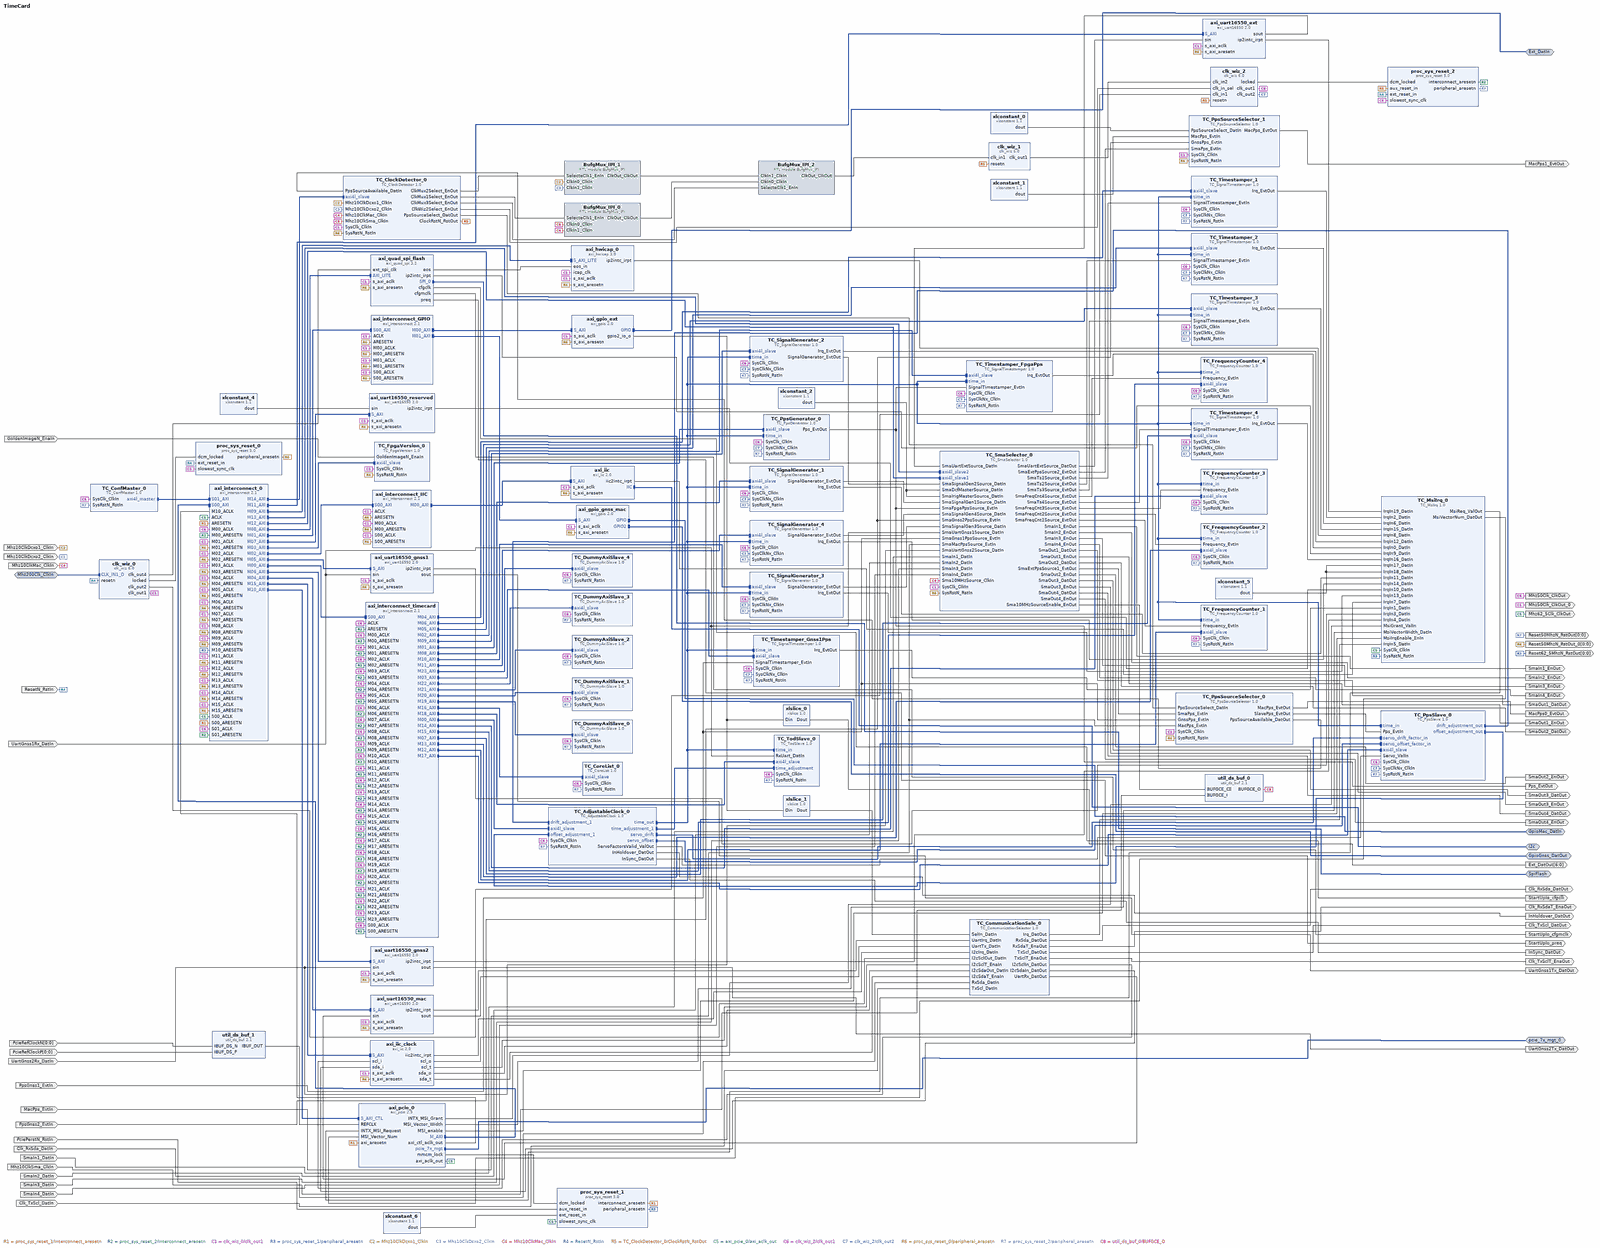
[diagram p0: block diagram of the top level, whole]
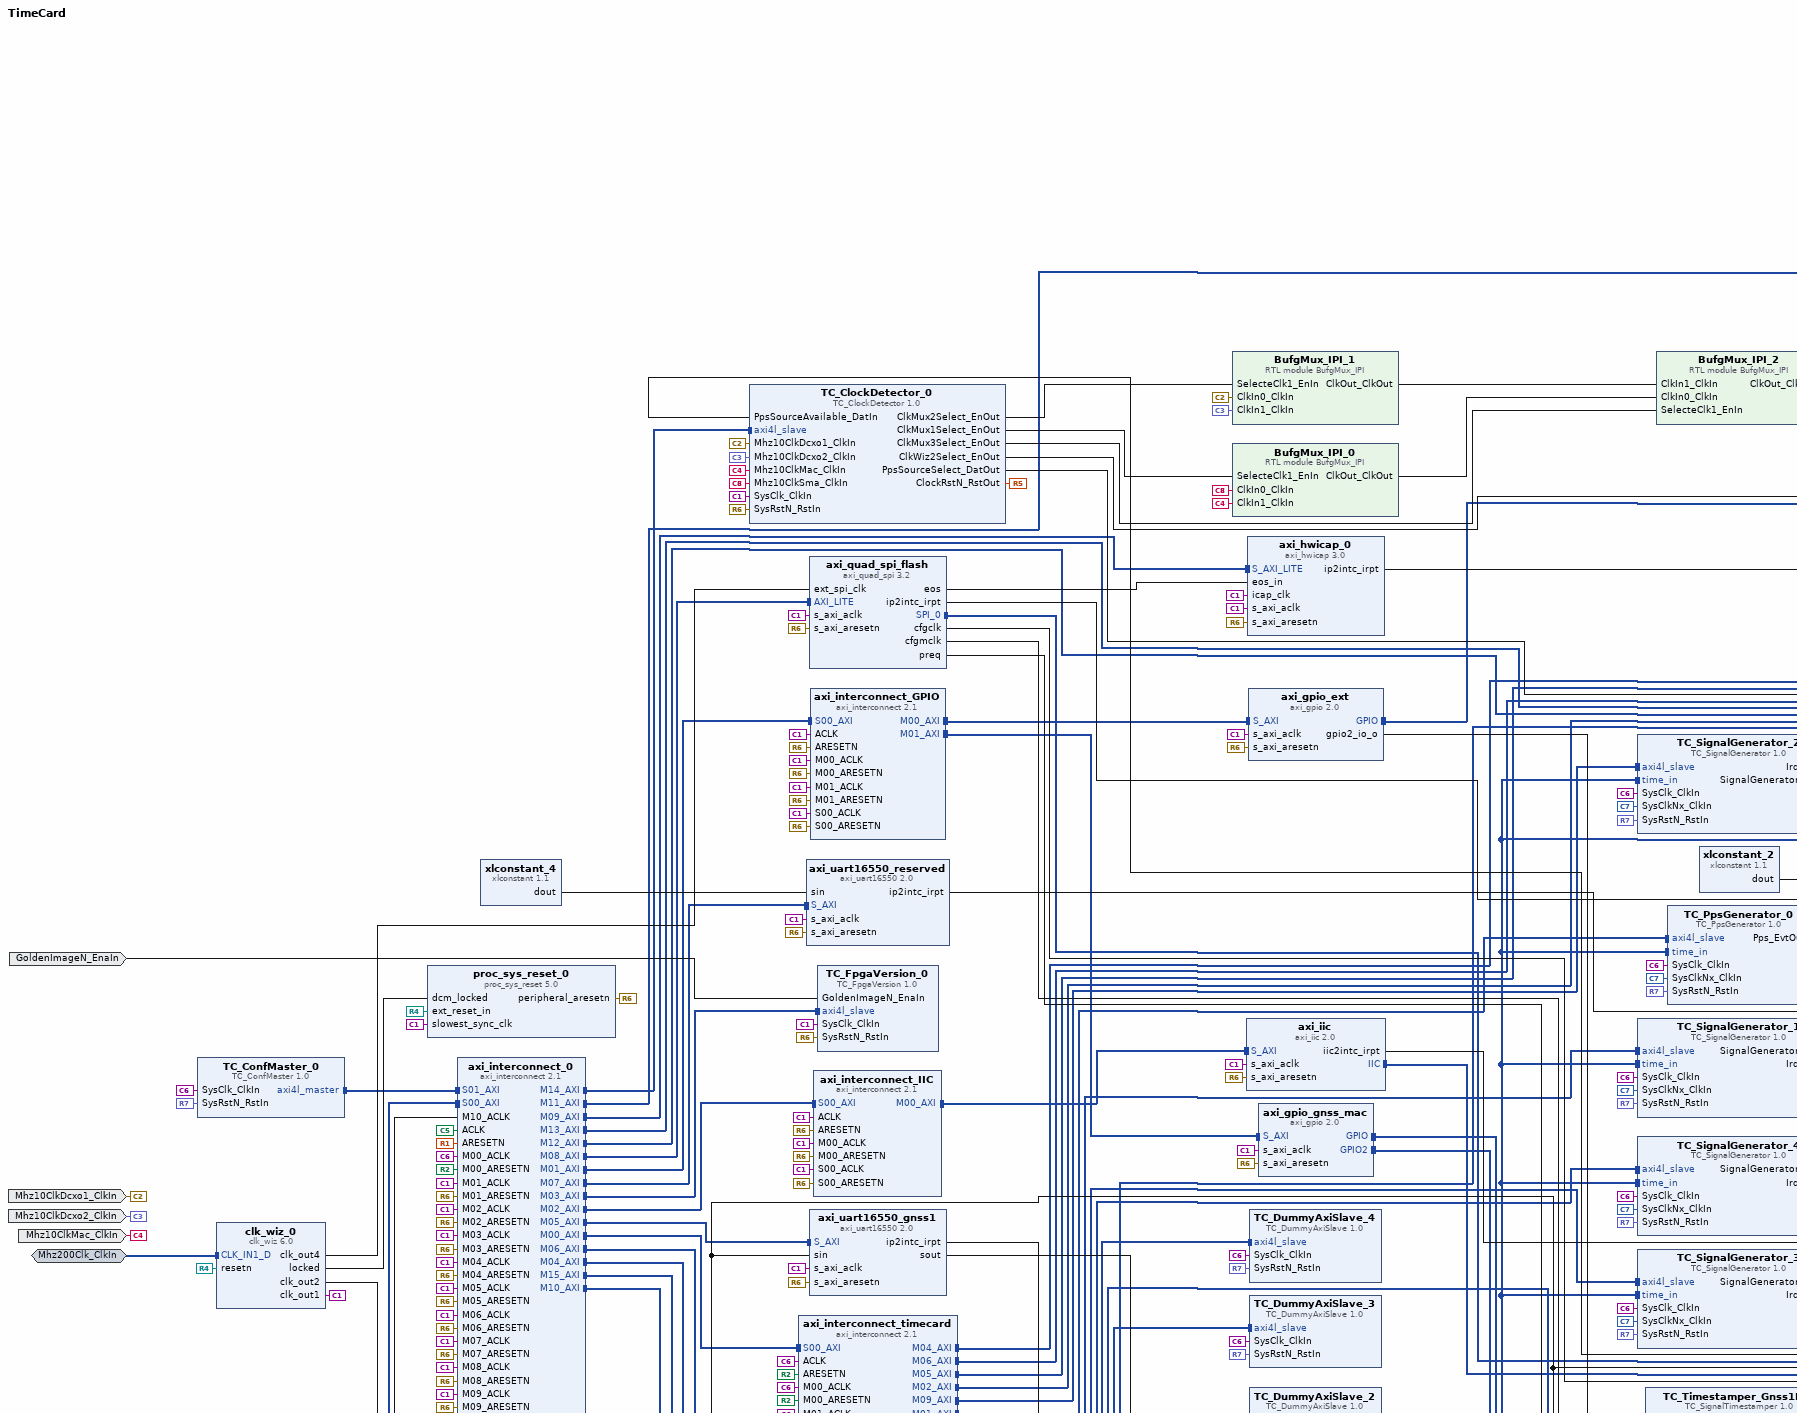
[diagram p1: block diagram of the top level, upper left part]
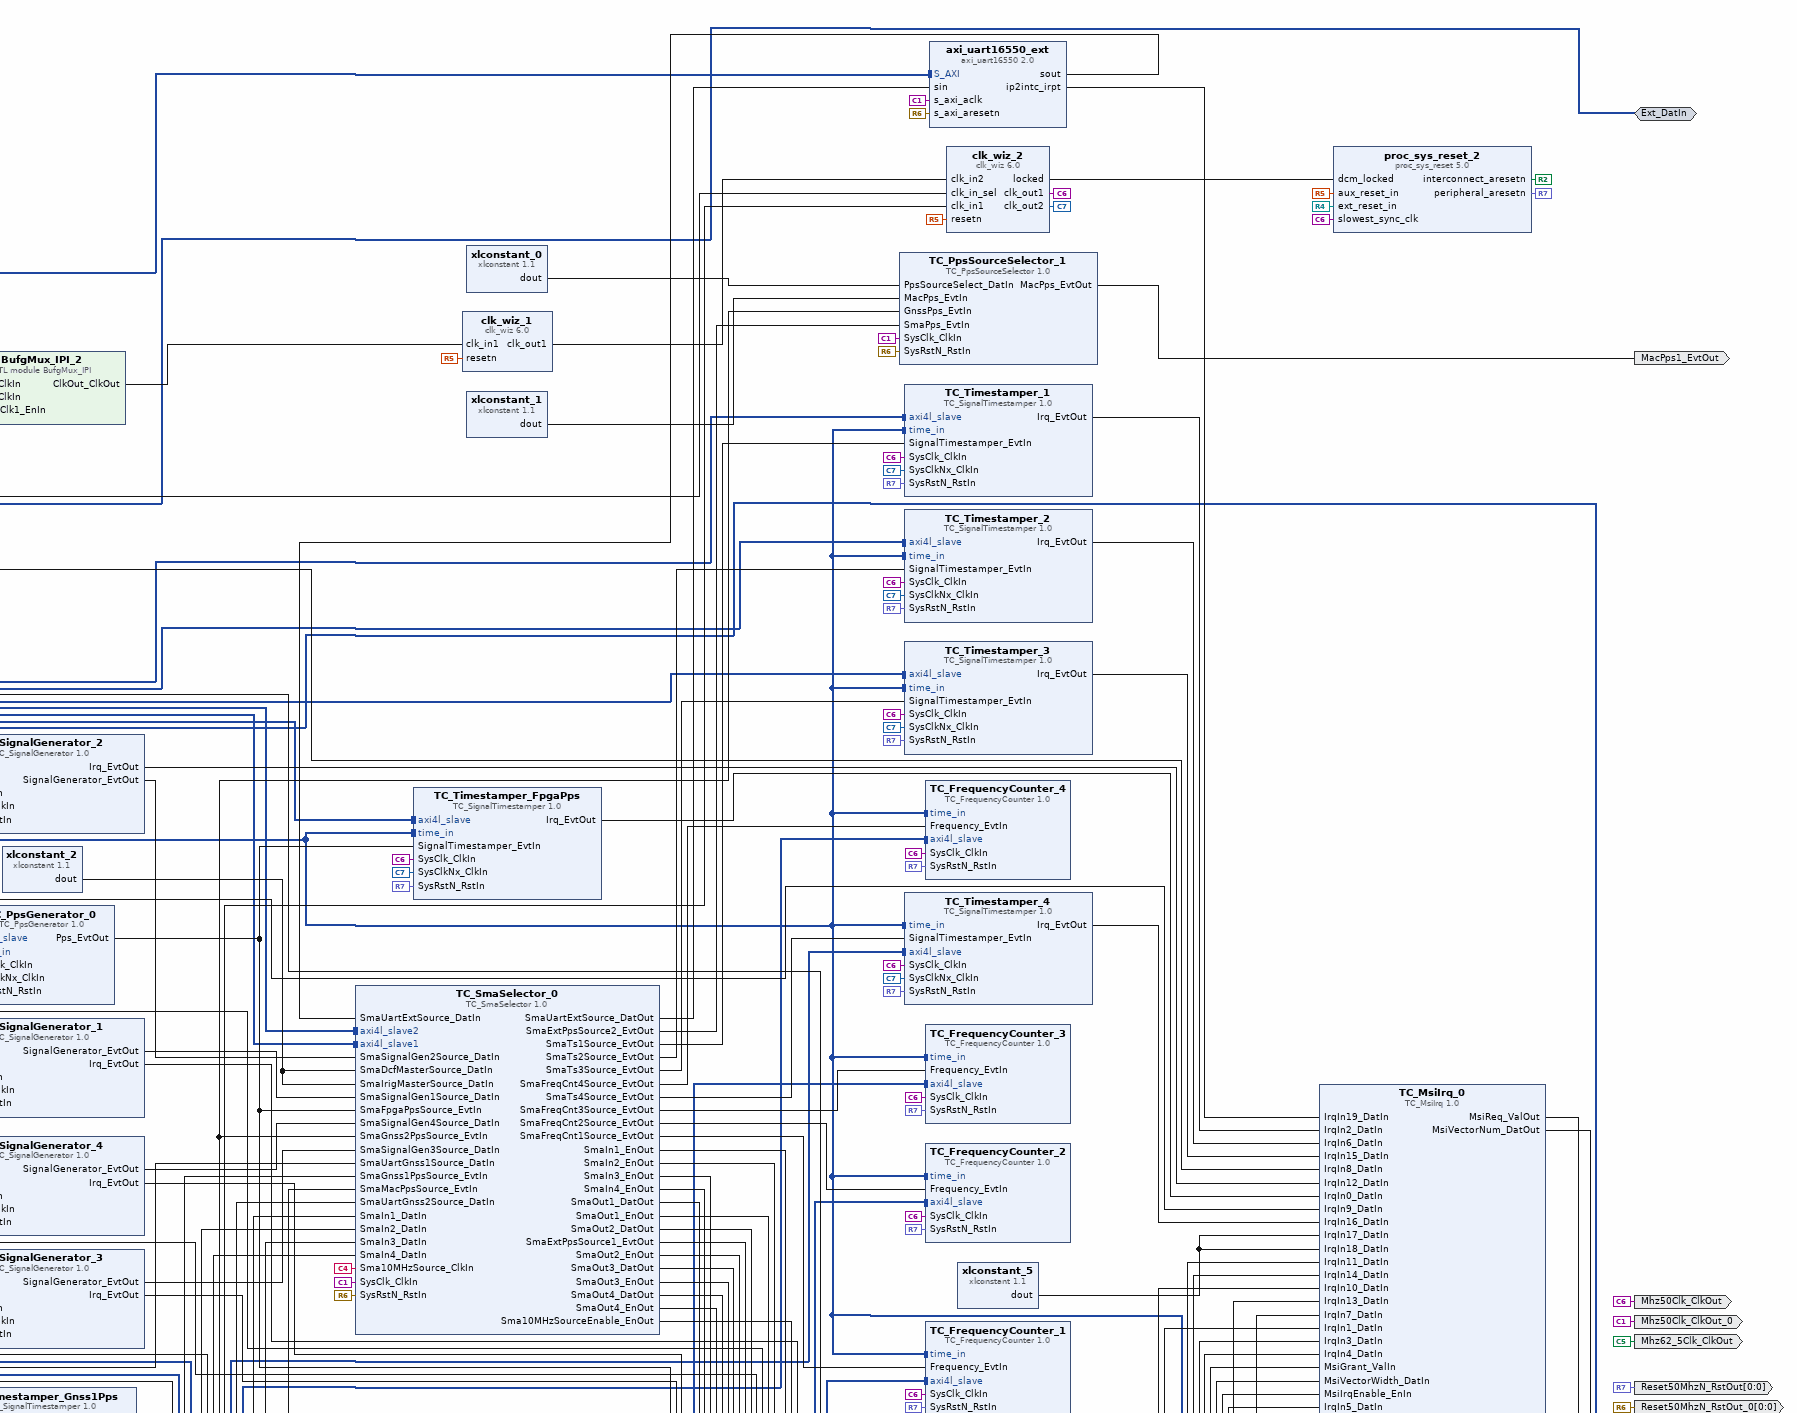
[diagram p2: block diagram of the top level, upper right part]
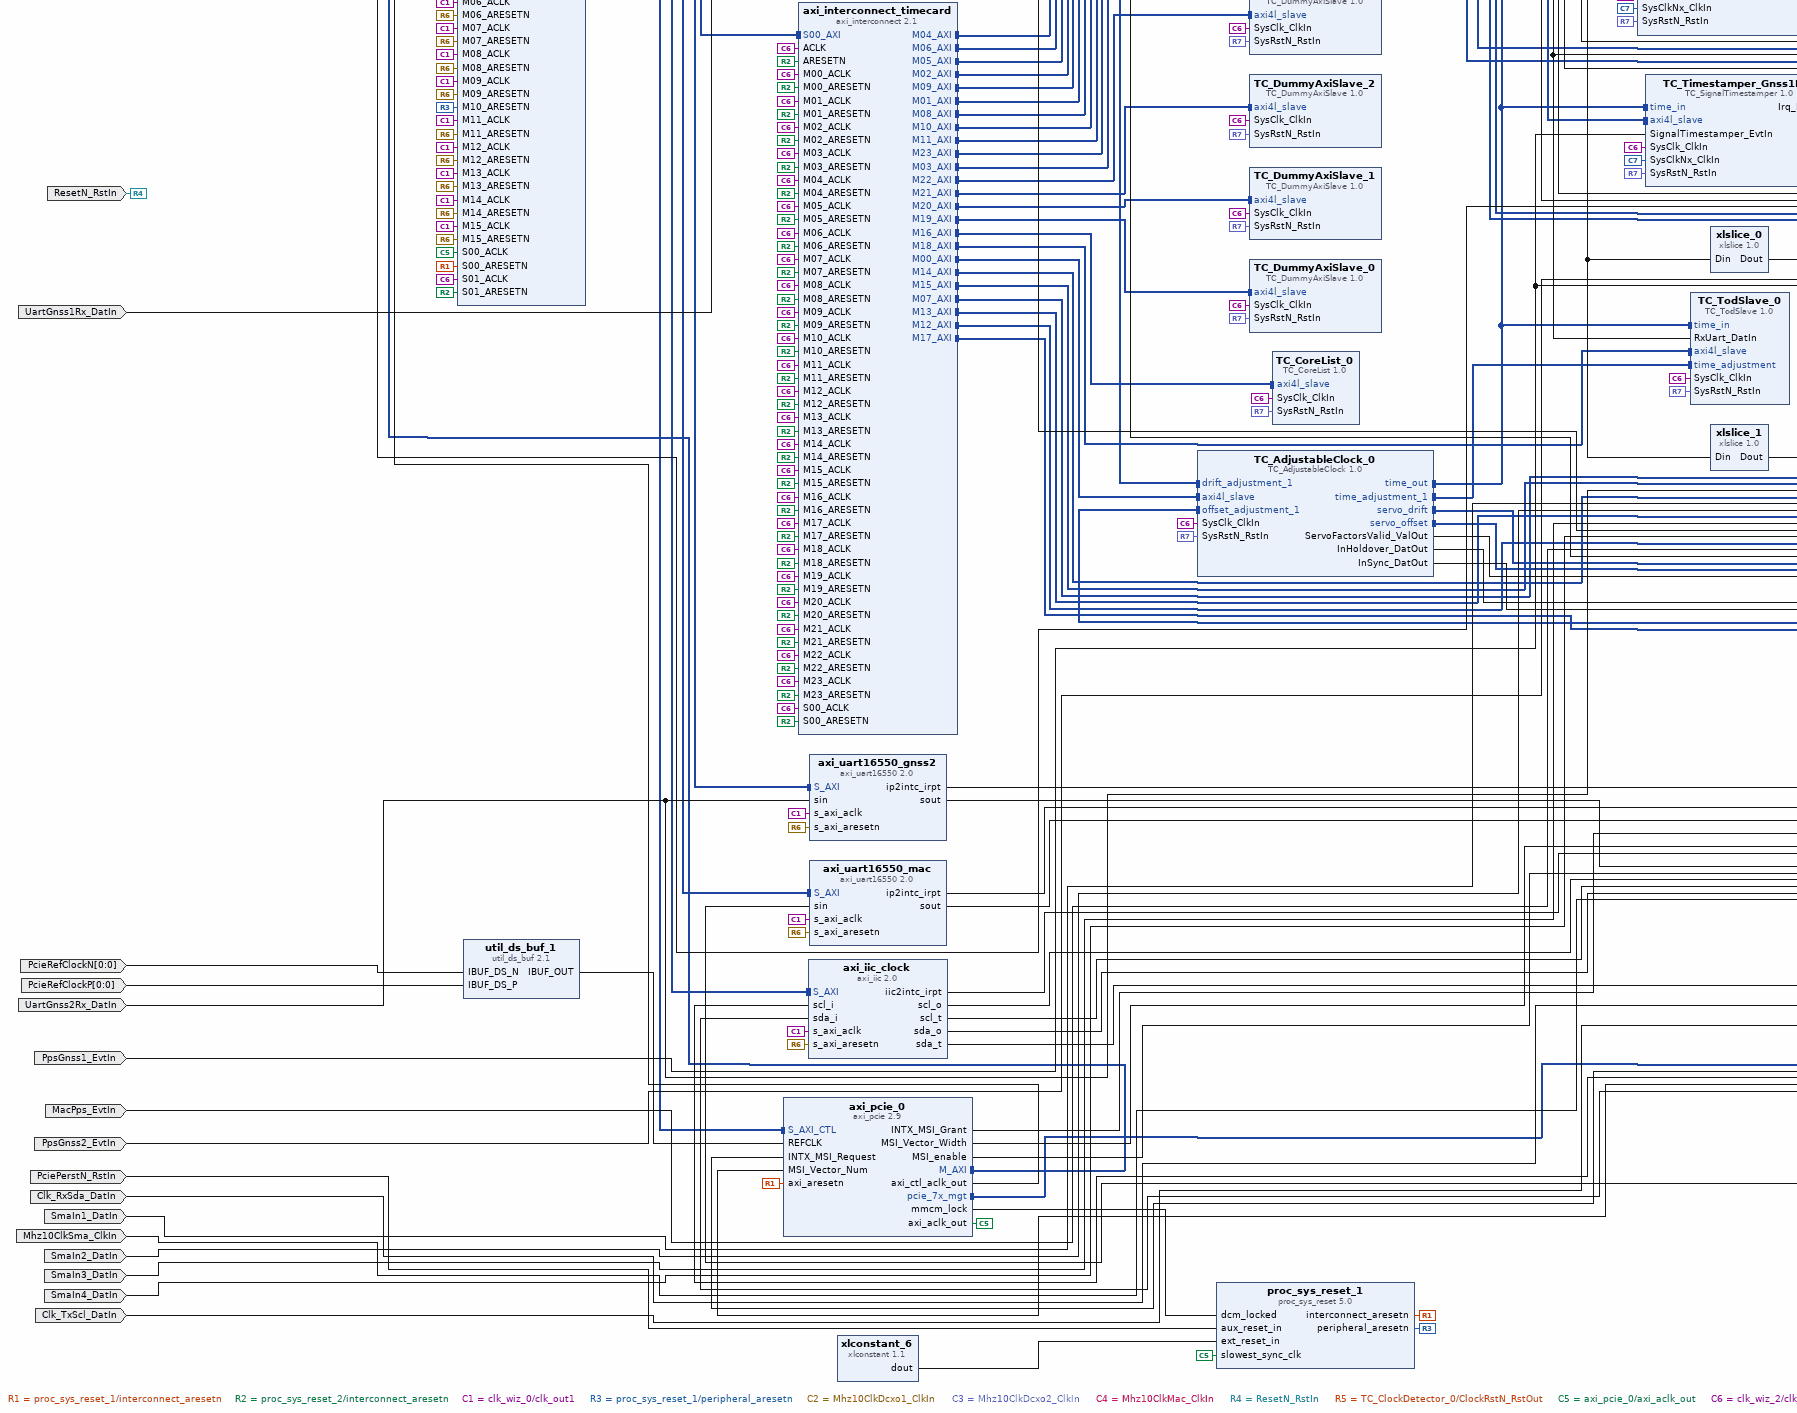
[diagram p3: block diagram of the top level, lower left part]
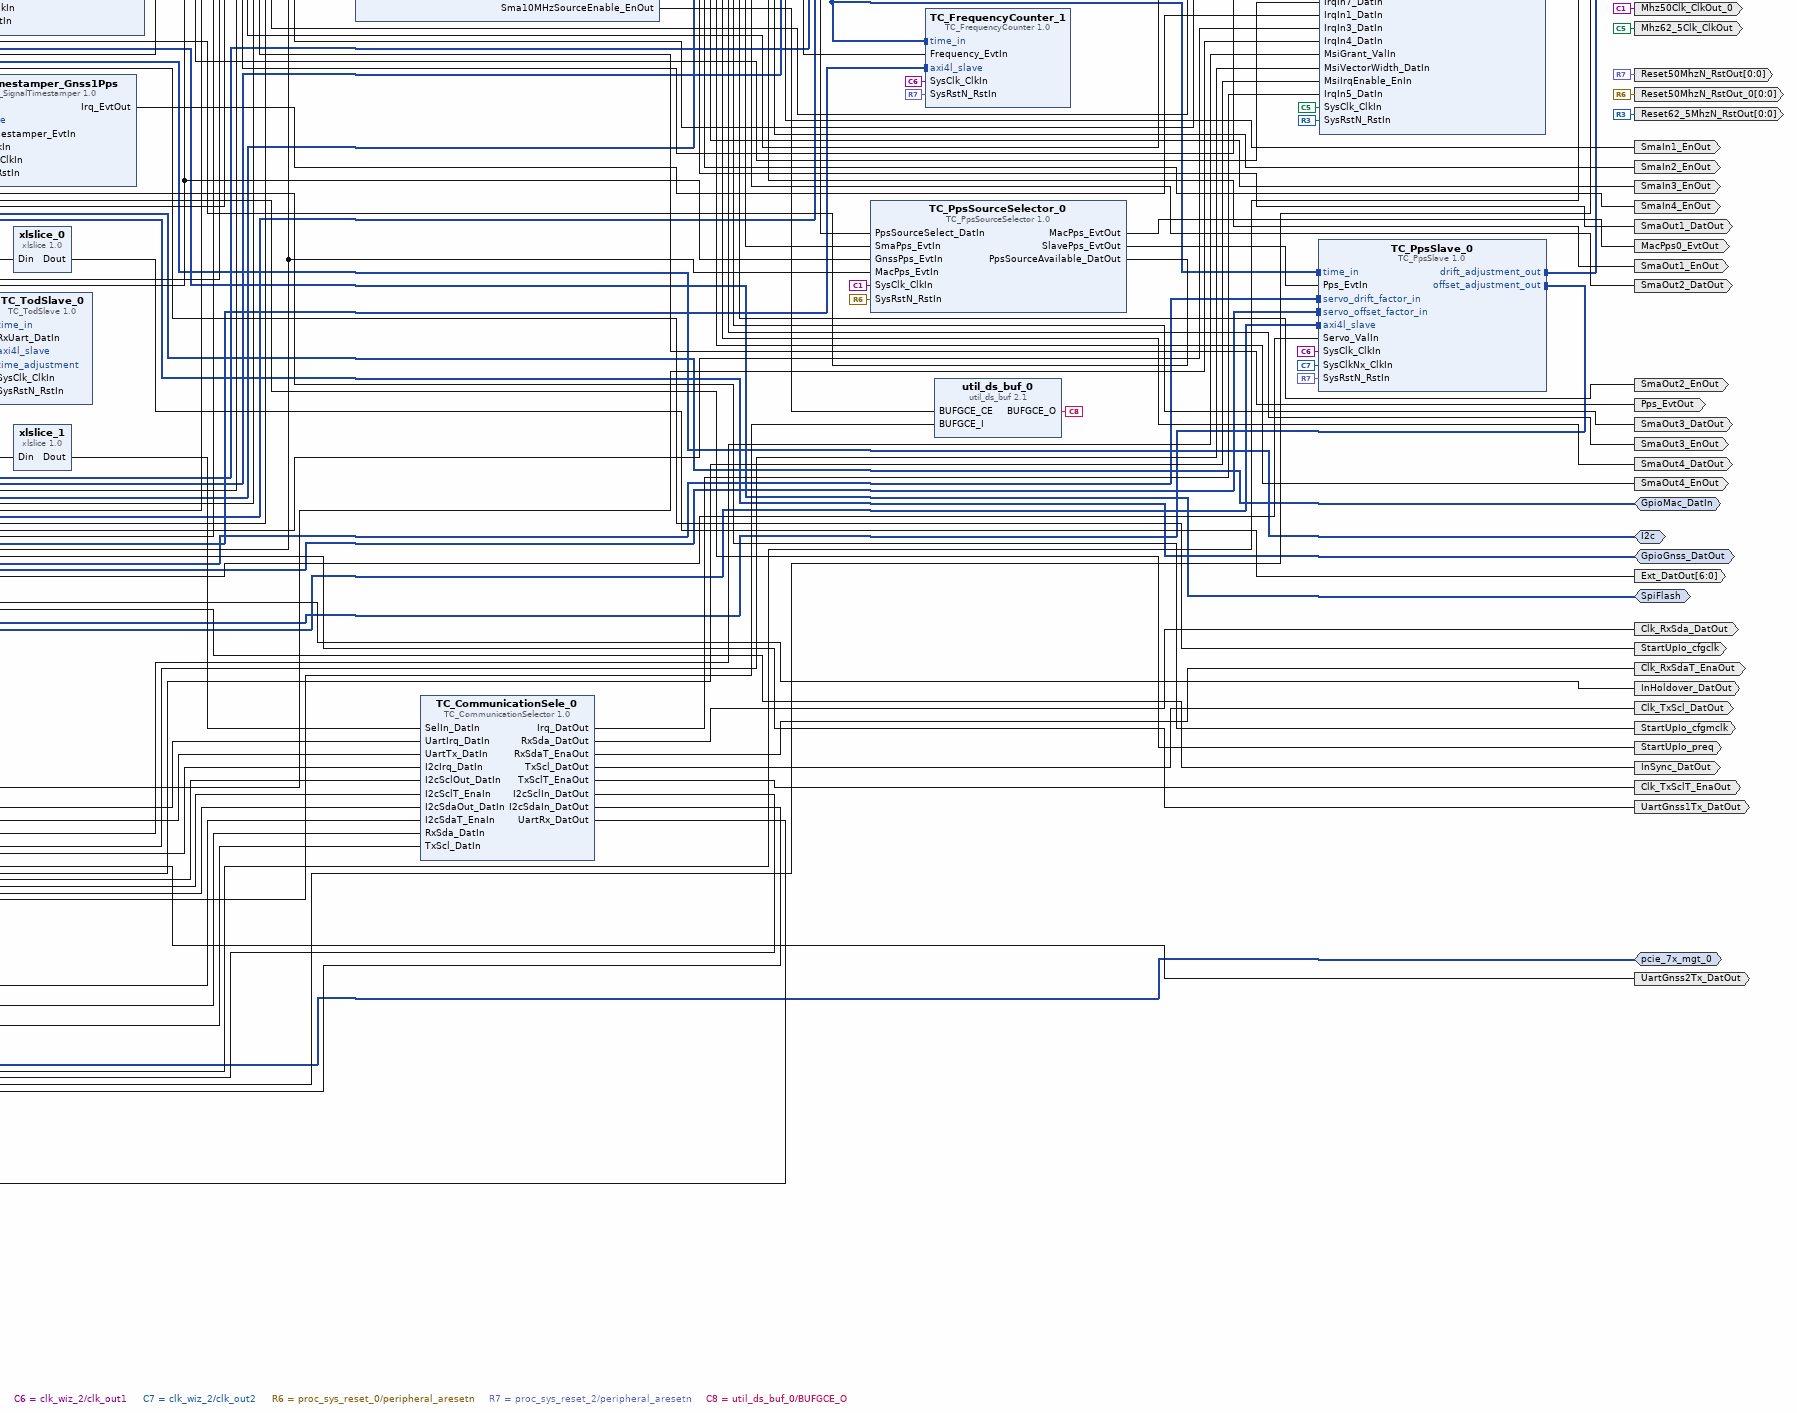
[diagram p4: block diagram of the top level, lower right part]
# Vivado block design TimeCard, xc7a100tfgg484-1, Vivado 2019.1
create_bd_design TimeCard

create_bd_intf_port -mode Master -vlnv xilinx.com:interface:gpio_rtl:1.0 Ext_DatIn
create_bd_intf_port -mode Master -vlnv xilinx.com:interface:gpio_rtl:1.0 GpioGnss_DatOut
create_bd_intf_port -mode Master -vlnv xilinx.com:interface:gpio_rtl:1.0 GpioMac_DatIn
create_bd_intf_port -mode Master -vlnv xilinx.com:interface:iic_rtl:1.0 I2c
create_bd_intf_port -mode Slave -vlnv xilinx.com:interface:diff_clock_rtl:1.0 Mhz200Clk_ClkIn
set_property -dict {CONFIG.FREQ_HZ 200000000} [get_bd_intf_ports Mhz200Clk_ClkIn]
create_bd_intf_port -mode Master -vlnv xilinx.com:interface:spi_rtl:1.0 SpiFlash
create_bd_intf_port -mode Master -vlnv xilinx.com:interface:pcie_7x_mgt_rtl:1.0 pcie_7x_mgt_0
create_bd_port -dir O Clk_RxSdaT_EnaOut
create_bd_port -dir I Clk_RxSda_DatIn
create_bd_port -dir O Clk_RxSda_DatOut
create_bd_port -dir O Clk_TxSclT_EnaOut
create_bd_port -dir I Clk_TxScl_DatIn
create_bd_port -dir O Clk_TxScl_DatOut
create_bd_port -dir O -from 6 -to 0 Ext_DatOut
create_bd_port -dir I -type rst GoldenImageN_EnaIn
create_bd_port -dir O InHoldover_DatOut
create_bd_port -dir O InSync_DatOut
create_bd_port -dir O MacPps0_EvtOut
create_bd_port -dir O MacPps1_EvtOut
create_bd_port -dir I MacPps_EvtIn
create_bd_port -dir I -type clk Mhz10ClkDcxo1_ClkIn
set_property -dict {CONFIG.FREQ_HZ 10000000} [get_bd_ports Mhz10ClkDcxo1_ClkIn]
create_bd_port -dir I -type clk Mhz10ClkDcxo2_ClkIn
set_property -dict {CONFIG.FREQ_HZ 10000000} [get_bd_ports Mhz10ClkDcxo2_ClkIn]
create_bd_port -dir I -type clk Mhz10ClkMac_ClkIn
set_property -dict {CONFIG.FREQ_HZ 10000000} [get_bd_ports Mhz10ClkMac_ClkIn]
create_bd_port -dir I -type clk Mhz10ClkSma_ClkIn
set_property -dict {CONFIG.FREQ_HZ 10000000} [get_bd_ports Mhz10ClkSma_ClkIn]
create_bd_port -dir O -type clk Mhz50Clk_ClkOut
create_bd_port -dir O -type clk Mhz50Clk_ClkOut_0
create_bd_port -dir O -type clk Mhz62_5Clk_ClkOut
create_bd_port -dir I -type rst PciePerstN_RstIn
create_bd_port -dir I -from 0 -to 0 -type clk PcieRefClockN
set_property -dict {CONFIG.FREQ_HZ 100000000} [get_bd_ports PcieRefClockN]
create_bd_port -dir I -from 0 -to 0 -type clk PcieRefClockP
set_property -dict {CONFIG.FREQ_HZ 100000000} [get_bd_ports PcieRefClockP]
create_bd_port -dir I PpsGnss1_EvtIn
create_bd_port -dir I PpsGnss2_EvtIn
create_bd_port -dir O -type data Pps_EvtOut
create_bd_port -dir O -from 0 -to 0 -type rst Reset50MhzN_RstOut
create_bd_port -dir O -from 0 -to 0 -type rst Reset50MhzN_RstOut_0
create_bd_port -dir O -from 0 -to 0 -type rst Reset62_5MhzN_RstOut
create_bd_port -dir I -type rst ResetN_RstIn
create_bd_port -dir I SmaIn1_DatIn
create_bd_port -dir O SmaIn1_EnOut
create_bd_port -dir I SmaIn2_DatIn
create_bd_port -dir O SmaIn2_EnOut
create_bd_port -dir I SmaIn3_DatIn
create_bd_port -dir O SmaIn3_EnOut
create_bd_port -dir I SmaIn4_DatIn
create_bd_port -dir O SmaIn4_EnOut
create_bd_port -dir O SmaOut1_DatOut
create_bd_port -dir O SmaOut1_EnOut
create_bd_port -dir O SmaOut2_DatOut
create_bd_port -dir O SmaOut2_EnOut
create_bd_port -dir O SmaOut3_DatOut
create_bd_port -dir O SmaOut3_EnOut
create_bd_port -dir O SmaOut4_DatOut
create_bd_port -dir O SmaOut4_EnOut
create_bd_port -dir O StartUpIo_cfgclk
create_bd_port -dir O StartUpIo_cfgmclk
create_bd_port -dir O StartUpIo_preq
create_bd_port -dir I UartGnss1Rx_DatIn
create_bd_port -dir O UartGnss1Tx_DatOut
create_bd_port -dir I UartGnss2Rx_DatIn
create_bd_port -dir O UartGnss2Tx_DatOut

create_bd_cell -type module -reference BufgMux_IPI BufgMux_IPI_0
create_bd_cell -type module -reference BufgMux_IPI BufgMux_IPI_1
create_bd_cell -type module -reference BufgMux_IPI BufgMux_IPI_2
create_bd_cell -type ip -vlnv nettimelogic.com:TimeCardLib:TC_AdjustableClock:1.0 TC_AdjustableClock_0
set_property -dict {CONFIG.ClockInSyncThreshold_Gen 500} [get_bd_cells TC_AdjustableClock_0]
create_bd_cell -type ip -vlnv nettimelogic.com:TimeCardLib:TC_ClockDetector:1.0 TC_ClockDetector_0
create_bd_cell -type ip -vlnv nettimelogic.com:TimeCardLib:TC_CommunicationSelector:1.0 TC_CommunicationSele_0
create_bd_cell -type ip -vlnv nettimelogic.com:TimeCardLib:TC_ConfMaster:1.0 TC_ConfMaster_0
set_property -dict [list \
  CONFIG.ConfigFile_Gen C:/Users/SHIWA/Documents/GitHub/Time-Appliance-Project/Time-Card/FPGA/Open-Source/Implementation/Xilinx/TimeCard/DefaultConfigFile.txt \
] [get_bd_cells TC_ConfMaster_0]
create_bd_cell -type ip -vlnv nettimelogic.com:TimeCardLib:TC_CoreList:1.0 TC_CoreList_0
set_property -dict [list \
  CONFIG.CoreListFile_Gen C:/Users/SHIWA/Documents/GitHub/Time-Appliance-Project/Time-Card/FPGA/Open-Source/Implementation/Xilinx/TimeCard/CoreListFile.txt \
] [get_bd_cells TC_CoreList_0]
create_bd_cell -type ip -vlnv nettimelogic.com:TimeCardLib:TC_DummyAxiSlave:1.0 TC_DummyAxiSlave_0
create_bd_cell -type ip -vlnv nettimelogic.com:TimeCardLib:TC_DummyAxiSlave:1.0 TC_DummyAxiSlave_1
create_bd_cell -type ip -vlnv nettimelogic.com:TimeCardLib:TC_DummyAxiSlave:1.0 TC_DummyAxiSlave_2
create_bd_cell -type ip -vlnv nettimelogic.com:TimeCardLib:TC_DummyAxiSlave:1.0 TC_DummyAxiSlave_3
create_bd_cell -type ip -vlnv nettimelogic.com:TimeCardLib:TC_DummyAxiSlave:1.0 TC_DummyAxiSlave_4
create_bd_cell -type ip -vlnv nettimelogic.com:TimeCardLib:TC_FpgaVersion:1.0 TC_FpgaVersion_0
set_property -dict {CONFIG.VersionNumber_Gen 0x0009 CONFIG.VersionNumber_Golden_Gen 0x0009} [get_bd_cells TC_FpgaVersion_0]
create_bd_cell -type ip -vlnv nettimelogic.com:TimeCardLib:TC_FrequencyCounter:1.0 TC_FrequencyCounter_1
create_bd_cell -type ip -vlnv nettimelogic.com:TimeCardLib:TC_FrequencyCounter:1.0 TC_FrequencyCounter_2
create_bd_cell -type ip -vlnv nettimelogic.com:TimeCardLib:TC_FrequencyCounter:1.0 TC_FrequencyCounter_3
create_bd_cell -type ip -vlnv nettimelogic.com:TimeCardLib:TC_FrequencyCounter:1.0 TC_FrequencyCounter_4
create_bd_cell -type ip -vlnv nettimelogic.com:TimeCardLib:TC_MsiIrq:1.0 TC_MsiIrq_0
set_property -dict {CONFIG.LevelInterrupt_Gen 0x000E05B8 CONFIG.NumberOfInterrupts_Gen 20} [get_bd_cells TC_MsiIrq_0]
create_bd_cell -type ip -vlnv nettimelogic.com:TimeCardLib:TC_PpsGenerator:1.0 TC_PpsGenerator_0
set_property -dict {CONFIG.CableDelay_Gen true CONFIG.HighResFreqMultiply_Gen 4} [get_bd_cells TC_PpsGenerator_0]
create_bd_cell -type ip -vlnv nettimelogic.com:TimeCardLib:TC_PpsSlave:1.0 TC_PpsSlave_0
create_bd_cell -type ip -vlnv nettimelogic.com:TimeCardLib:TC_PpsSourceSelector:1.0 TC_PpsSourceSelector_0
create_bd_cell -type ip -vlnv nettimelogic.com:TimeCardLib:TC_PpsSourceSelector:1.0 TC_PpsSourceSelector_1
create_bd_cell -type ip -vlnv nettimelogic.com:TimeCardLib:TC_SignalGenerator:1.0 TC_SignalGenerator_1
set_property -dict [list \
  CONFIG.CableDelay_Gen true \
  CONFIG.HighResFreqMultiply_Gen 4 \
  CONFIG.OutputDelay_Gen 0 \
] [get_bd_cells TC_SignalGenerator_1]
create_bd_cell -type ip -vlnv nettimelogic.com:TimeCardLib:TC_SignalGenerator:1.0 TC_SignalGenerator_2
set_property -dict [list \
  CONFIG.CableDelay_Gen true \
  CONFIG.HighResFreqMultiply_Gen 4 \
  CONFIG.OutputDelay_Gen 0 \
] [get_bd_cells TC_SignalGenerator_2]
create_bd_cell -type ip -vlnv nettimelogic.com:TimeCardLib:TC_SignalGenerator:1.0 TC_SignalGenerator_3
set_property -dict [list \
  CONFIG.CableDelay_Gen true \
  CONFIG.HighResFreqMultiply_Gen 4 \
  CONFIG.OutputDelay_Gen 0 \
] [get_bd_cells TC_SignalGenerator_3]
create_bd_cell -type ip -vlnv nettimelogic.com:TimeCardLib:TC_SignalGenerator:1.0 TC_SignalGenerator_4
set_property -dict [list \
  CONFIG.CableDelay_Gen true \
  CONFIG.HighResFreqMultiply_Gen 4 \
  CONFIG.OutputDelay_Gen 0 \
] [get_bd_cells TC_SignalGenerator_4]
create_bd_cell -type ip -vlnv nettimelogic.com:TimeCardLib:TC_SmaSelector:1.0 TC_SmaSelector_0
create_bd_cell -type ip -vlnv nettimelogic.com:TimeCardLib:TC_SignalTimestamper:1.0 TC_Timestamper_1
set_property -dict [list \
  CONFIG.CableDelay_Gen true \
  CONFIG.HighResFreqMultiply_Gen 4 \
  CONFIG.InputDelay_Gen 0 \
] [get_bd_cells TC_Timestamper_1]
create_bd_cell -type ip -vlnv nettimelogic.com:TimeCardLib:TC_SignalTimestamper:1.0 TC_Timestamper_2
set_property -dict [list \
  CONFIG.CableDelay_Gen true \
  CONFIG.HighResFreqMultiply_Gen 4 \
  CONFIG.InputDelay_Gen 0 \
] [get_bd_cells TC_Timestamper_2]
create_bd_cell -type ip -vlnv nettimelogic.com:TimeCardLib:TC_SignalTimestamper:1.0 TC_Timestamper_3
set_property -dict [list \
  CONFIG.CableDelay_Gen true \
  CONFIG.HighResFreqMultiply_Gen 4 \
  CONFIG.InputDelay_Gen 0 \
] [get_bd_cells TC_Timestamper_3]
create_bd_cell -type ip -vlnv nettimelogic.com:TimeCardLib:TC_SignalTimestamper:1.0 TC_Timestamper_4
set_property -dict [list \
  CONFIG.CableDelay_Gen true \
  CONFIG.HighResFreqMultiply_Gen 4 \
  CONFIG.InputDelay_Gen 0 \
] [get_bd_cells TC_Timestamper_4]
create_bd_cell -type ip -vlnv nettimelogic.com:TimeCardLib:TC_SignalTimestamper:1.0 TC_Timestamper_FpgaPps
set_property -dict [list \
  CONFIG.CableDelay_Gen true \
  CONFIG.HighResFreqMultiply_Gen 4 \
  CONFIG.InputDelay_Gen 0 \
] [get_bd_cells TC_Timestamper_FpgaPps]
create_bd_cell -type ip -vlnv nettimelogic.com:TimeCardLib:TC_SignalTimestamper:1.0 TC_Timestamper_Gnss1Pps
set_property -dict [list \
  CONFIG.CableDelay_Gen true \
  CONFIG.HighResFreqMultiply_Gen 4 \
  CONFIG.InputDelay_Gen 0 \
] [get_bd_cells TC_Timestamper_Gnss1Pps]
create_bd_cell -type ip -vlnv nettimelogic.com:TimeCardLib:TC_TodSlave:1.0 TC_TodSlave_0
set_property -dict {CONFIG.UartDefaultBaudRate_Gen 4} [get_bd_cells TC_TodSlave_0]
create_bd_cell -type ip -vlnv xilinx.com:ip:axi_gpio:2.0 axi_gpio_ext
set_property -dict [list \
  CONFIG.C_ALL_INPUTS 1 \
  CONFIG.C_ALL_OUTPUTS_2 1 \
  CONFIG.C_DOUT_DEFAULT_2 0x00000060 \
  CONFIG.C_GPIO2_WIDTH 32 \
  CONFIG.C_GPIO_WIDTH 2 \
  CONFIG.C_IS_DUAL 1 \
] [get_bd_cells axi_gpio_ext]
create_bd_cell -type ip -vlnv xilinx.com:ip:axi_gpio:2.0 axi_gpio_gnss_mac
set_property -dict [list \
  CONFIG.C_ALL_INPUTS 1 \
  CONFIG.C_ALL_OUTPUTS_2 1 \
  CONFIG.C_GPIO2_WIDTH 2 \
  CONFIG.C_GPIO_WIDTH 2 \
  CONFIG.C_IS_DUAL 1 \
] [get_bd_cells axi_gpio_gnss_mac]
create_bd_cell -type ip -vlnv xilinx.com:ip:axi_hwicap:3.0 axi_hwicap_0
create_bd_cell -type ip -vlnv xilinx.com:ip:axi_iic:2.0 axi_iic
create_bd_cell -type ip -vlnv xilinx.com:ip:axi_iic:2.0 axi_iic_clock
create_bd_cell -type ip -vlnv xilinx.com:ip:axi_interconnect:2.1 axi_interconnect_0
set_property -dict [list \
  CONFIG.M00_HAS_REGSLICE 3 \
  CONFIG.M01_HAS_REGSLICE 3 \
  CONFIG.M02_HAS_REGSLICE 3 \
  CONFIG.M03_HAS_REGSLICE 3 \
  CONFIG.M04_HAS_REGSLICE 3 \
  CONFIG.M05_HAS_REGSLICE 3 \
  CONFIG.M06_HAS_REGSLICE 3 \
  CONFIG.M07_HAS_REGSLICE 3 \
  CONFIG.M08_HAS_REGSLICE 3 \
  CONFIG.M09_HAS_REGSLICE 3 \
  CONFIG.M10_HAS_REGSLICE 3 \
  CONFIG.M11_HAS_REGSLICE 3 \
  CONFIG.M12_HAS_REGSLICE 3 \
  CONFIG.M13_HAS_REGSLICE 3 \
  CONFIG.M14_HAS_REGSLICE 3 \
  CONFIG.NUM_MI 16 \
  CONFIG.NUM_SI 2 \
  CONFIG.S00_HAS_REGSLICE 3 \
  CONFIG.S01_HAS_REGSLICE 3 \
] [get_bd_cells axi_interconnect_0]
create_bd_cell -type ip -vlnv xilinx.com:ip:axi_interconnect:2.1 axi_interconnect_GPIO
create_bd_cell -type ip -vlnv xilinx.com:ip:axi_interconnect:2.1 axi_interconnect_IIC
set_property -dict {CONFIG.NUM_MI 1} [get_bd_cells axi_interconnect_IIC]
create_bd_cell -type ip -vlnv xilinx.com:ip:axi_interconnect:2.1 axi_interconnect_timecard
set_property -dict {CONFIG.NUM_MI 24} [get_bd_cells axi_interconnect_timecard]
create_bd_cell -type ip -vlnv xilinx.com:ip:axi_pcie:2.9 axi_pcie_0
set_property -dict [list \
  CONFIG.AXIBAR2PCIEBAR_0 0x00000000 \
  CONFIG.BAR0_SCALE Megabytes \
  CONFIG.BAR0_SIZE 32 \
  CONFIG.DEVICE_ID 0x0400 \
  CONFIG.INCLUDE_BAROFFSET_REG false \
  CONFIG.NUM_MSI_REQ 5 \
  CONFIG.SLOT_CLOCK_CONFIG false \
  CONFIG.S_AXI_SUPPORTS_NARROW_BURST false \
  CONFIG.VENDOR_ID 0x1D9B \
  CONFIG.shared_logic_in_core true \
] [get_bd_cells axi_pcie_0]
create_bd_cell -type ip -vlnv xilinx.com:ip:axi_quad_spi:3.2 axi_quad_spi_flash
set_property -dict {CONFIG.C_FIFO_DEPTH 256 CONFIG.C_SPI_MEMORY 2 CONFIG.C_SPI_MODE 2} [get_bd_cells axi_quad_spi_flash]
create_bd_cell -type ip -vlnv xilinx.com:ip:axi_uart16550:2.0 axi_uart16550_ext
set_property -dict {CONFIG.C_S_AXI_ACLK_FREQ_HZ 50000000} [get_bd_cells axi_uart16550_ext]
create_bd_cell -type ip -vlnv xilinx.com:ip:axi_uart16550:2.0 axi_uart16550_gnss1
set_property -dict {CONFIG.C_S_AXI_ACLK_FREQ_HZ 50000000} [get_bd_cells axi_uart16550_gnss1]
create_bd_cell -type ip -vlnv xilinx.com:ip:axi_uart16550:2.0 axi_uart16550_gnss2
set_property -dict {CONFIG.C_S_AXI_ACLK_FREQ_HZ 50000000} [get_bd_cells axi_uart16550_gnss2]
create_bd_cell -type ip -vlnv xilinx.com:ip:axi_uart16550:2.0 axi_uart16550_mac
set_property -dict {CONFIG.C_S_AXI_ACLK_FREQ_HZ 50000000} [get_bd_cells axi_uart16550_mac]
create_bd_cell -type ip -vlnv xilinx.com:ip:axi_uart16550:2.0 axi_uart16550_reserved
set_property -dict {CONFIG.C_S_AXI_ACLK_FREQ_HZ 50000000} [get_bd_cells axi_uart16550_reserved]
create_bd_cell -type ip -vlnv xilinx.com:ip:clk_wiz:6.0 clk_wiz_0
set_property -dict [list \
  CONFIG.CLKIN1_JITTER_PS 50.0 \
  CONFIG.CLKOUT1_JITTER 129.198 \
  CONFIG.CLKOUT1_PHASE_ERROR 89.971 \
  CONFIG.CLKOUT1_REQUESTED_OUT_FREQ 50.000 \
  CONFIG.CLKOUT2_JITTER 98.146 \
  CONFIG.CLKOUT2_PHASE_ERROR 89.971 \
  CONFIG.CLKOUT2_REQUESTED_OUT_FREQ 200.000 \
  CONFIG.CLKOUT2_USED true \
  CONFIG.CLKOUT3_JITTER 148.629 \
  CONFIG.CLKOUT3_PHASE_ERROR 89.971 \
  CONFIG.CLKOUT3_REQUESTED_OUT_FREQ 25.000 \
  CONFIG.CLKOUT3_USED true \
  CONFIG.CLKOUT4_JITTER 129.198 \
  CONFIG.CLKOUT4_PHASE_ERROR 89.971 \
  CONFIG.CLKOUT4_REQUESTED_OUT_FREQ 50.000 \
  CONFIG.CLKOUT4_USED true \
  CONFIG.MMCM_CLKFBOUT_MULT_F 5.000 \
  CONFIG.MMCM_CLKIN1_PERIOD 5.000 \
  CONFIG.MMCM_CLKIN2_PERIOD 10.0 \
  CONFIG.MMCM_CLKOUT0_DIVIDE_F 20.000 \
  CONFIG.MMCM_CLKOUT1_DIVIDE 5 \
  CONFIG.MMCM_CLKOUT2_DIVIDE 40 \
  CONFIG.MMCM_CLKOUT3_DIVIDE 20 \
  CONFIG.NUM_OUT_CLKS 4 \
  CONFIG.PRIM_IN_FREQ 200.000 \
  CONFIG.PRIM_SOURCE Differential_clock_capable_pin \
  CONFIG.RESET_PORT resetn \
  CONFIG.RESET_TYPE ACTIVE_LOW \
] [get_bd_cells clk_wiz_0]
create_bd_cell -type ip -vlnv xilinx.com:ip:clk_wiz:6.0 clk_wiz_1
set_property -dict [list \
  CONFIG.CLKIN1_JITTER_PS 10 \
  CONFIG.CLKIN1_UI_JITTER 10 \
  CONFIG.CLKIN2_JITTER_PS 100.000 \
  CONFIG.CLKIN2_UI_JITTER 100.000 \
  CONFIG.CLKOUT1_JITTER 552.367 \
  CONFIG.CLKOUT1_PHASE_ERROR 883.386 \
  CONFIG.CLKOUT1_REQUESTED_OUT_FREQ 200.000 \
  CONFIG.JITTER_OPTIONS PS \
  CONFIG.MMCM_CLKFBOUT_MULT_F 62.500 \
  CONFIG.MMCM_CLKIN1_PERIOD 100.000 \
  CONFIG.MMCM_CLKIN2_PERIOD 10.0 \
  CONFIG.MMCM_CLKOUT0_DIVIDE_F 3.125 \
  CONFIG.MMCM_REF_JITTER1 0.000 \
  CONFIG.MMCM_REF_JITTER2 0.010 \
  CONFIG.PRIM_IN_FREQ 10.000 \
  CONFIG.PRIM_SOURCE No_buffer \
  CONFIG.RESET_PORT resetn \
  CONFIG.RESET_TYPE ACTIVE_LOW \
  CONFIG.USE_LOCKED false \
] [get_bd_cells clk_wiz_1]
create_bd_cell -type ip -vlnv xilinx.com:ip:clk_wiz:6.0 clk_wiz_2
set_property -dict [list \
  CONFIG.CLKIN1_JITTER_PS 50.0 \
  CONFIG.CLKIN2_JITTER_PS 50.0 \
  CONFIG.CLKOUT1_JITTER 129.198 \
  CONFIG.CLKOUT1_PHASE_ERROR 89.971 \
  CONFIG.CLKOUT1_REQUESTED_OUT_FREQ 50.000 \
  CONFIG.CLKOUT2_JITTER 98.146 \
  CONFIG.CLKOUT2_PHASE_ERROR 89.971 \
  CONFIG.CLKOUT2_REQUESTED_OUT_FREQ 200.000 \
  CONFIG.CLKOUT2_USED true \
  CONFIG.MMCM_CLKFBOUT_MULT_F 5.000 \
  CONFIG.MMCM_CLKIN1_PERIOD 5.000 \
  CONFIG.MMCM_CLKIN2_PERIOD 5.000 \
  CONFIG.MMCM_CLKOUT0_DIVIDE_F 20.000 \
  CONFIG.MMCM_CLKOUT1_DIVIDE 5 \
  CONFIG.NUM_OUT_CLKS 2 \
  CONFIG.PRIM_IN_FREQ 200.000 \
  CONFIG.PRIM_SOURCE No_buffer \
  CONFIG.RESET_PORT resetn \
  CONFIG.RESET_TYPE ACTIVE_LOW \
  CONFIG.SECONDARY_IN_FREQ 200.00 \
  CONFIG.SECONDARY_SOURCE No_buffer \
  CONFIG.USE_INCLK_SWITCHOVER true \
] [get_bd_cells clk_wiz_2]
create_bd_cell -type ip -vlnv xilinx.com:ip:proc_sys_reset:5.0 proc_sys_reset_0
set_property -dict {CONFIG.C_AUX_RESET_HIGH 0} [get_bd_cells proc_sys_reset_0]
create_bd_cell -type ip -vlnv xilinx.com:ip:proc_sys_reset:5.0 proc_sys_reset_1
set_property -dict {CONFIG.C_AUX_RESET_HIGH 0 CONFIG.C_AUX_RST_WIDTH 16 CONFIG.C_EXT_RST_WIDTH 16} [get_bd_cells proc_sys_reset_1]
create_bd_cell -type ip -vlnv xilinx.com:ip:proc_sys_reset:5.0 proc_sys_reset_2
set_property -dict {CONFIG.C_AUX_RESET_HIGH 0 CONFIG.C_EXT_RST_WIDTH 4} [get_bd_cells proc_sys_reset_2]
create_bd_cell -type ip -vlnv xilinx.com:ip:util_ds_buf:2.1 util_ds_buf_0
set_property -dict {CONFIG.C_BUF_TYPE BUFGCE} [get_bd_cells util_ds_buf_0]
create_bd_cell -type ip -vlnv xilinx.com:ip:util_ds_buf:2.1 util_ds_buf_1
set_property -dict {CONFIG.C_BUF_TYPE IBUFDSGTE} [get_bd_cells util_ds_buf_1]
create_bd_cell -type ip -vlnv xilinx.com:ip:xlconstant:1.1 xlconstant_0
set_property -dict {CONFIG.CONST_VAL 0 CONFIG.CONST_WIDTH 2} [get_bd_cells xlconstant_0]
create_bd_cell -type ip -vlnv xilinx.com:ip:xlconstant:1.1 xlconstant_1
set_property -dict {CONFIG.CONST_VAL 0 CONFIG.CONST_WIDTH 1} [get_bd_cells xlconstant_1]
create_bd_cell -type ip -vlnv xilinx.com:ip:xlconstant:1.1 xlconstant_2
create_bd_cell -type ip -vlnv xilinx.com:ip:xlconstant:1.1 xlconstant_4
create_bd_cell -type ip -vlnv xilinx.com:ip:xlconstant:1.1 xlconstant_5
set_property -dict {CONFIG.CONST_VAL 0} [get_bd_cells xlconstant_5]
create_bd_cell -type ip -vlnv xilinx.com:ip:xlconstant:1.1 xlconstant_6
set_property -dict {CONFIG.CONST_VAL 1} [get_bd_cells xlconstant_6]
create_bd_cell -type ip -vlnv xilinx.com:ip:xlslice:1.0 xlslice_0
set_property -dict {CONFIG.DIN_FROM 6 CONFIG.DOUT_WIDTH 7} [get_bd_cells xlslice_0]
create_bd_cell -type ip -vlnv xilinx.com:ip:xlslice:1.0 xlslice_1
set_property -dict {CONFIG.DIN_FROM 31 CONFIG.DIN_TO 31 CONFIG.DOUT_WIDTH 1} [get_bd_cells xlslice_1]

# ---- connections ----

connect_bd_intf_net [get_bd_intf_pins TC_ConfMaster_0/axi4l_master] [get_bd_intf_pins axi_interconnect_0/S01_AXI]
connect_bd_intf_net [get_bd_intf_ports GpioMac_DatIn] [get_bd_intf_pins axi_gpio_gnss_mac/GPIO]
connect_bd_intf_net [get_bd_intf_pins TC_AdjustableClock_0/drift_adjustment_1] [get_bd_intf_pins TC_PpsSlave_0/drift_adjustment_out]
connect_bd_intf_net [get_bd_intf_pins TC_AdjustableClock_0/offset_adjustment_1] [get_bd_intf_pins TC_PpsSlave_0/offset_adjustment_out]
connect_bd_intf_net [get_bd_intf_pins TC_AdjustableClock_0/time_adjustment_1] [get_bd_intf_pins TC_TodSlave_0/time_adjustment]
connect_bd_intf_net [get_bd_intf_ports Ext_DatIn] [get_bd_intf_pins axi_gpio_ext/GPIO]
connect_bd_intf_net [get_bd_intf_pins TC_AdjustableClock_0/time_out] [get_bd_intf_pins TC_PpsSlave_0/time_in]
connect_bd_intf_net [get_bd_intf_pins TC_AdjustableClock_0/time_out] [get_bd_intf_pins TC_FrequencyCounter_1/time_in]
connect_bd_intf_net [get_bd_intf_pins TC_AdjustableClock_0/time_out] [get_bd_intf_pins TC_FrequencyCounter_2/time_in]
connect_bd_intf_net [get_bd_intf_pins TC_AdjustableClock_0/time_out] [get_bd_intf_pins TC_FrequencyCounter_3/time_in]
connect_bd_intf_net [get_bd_intf_pins TC_AdjustableClock_0/time_out] [get_bd_intf_pins TC_FrequencyCounter_4/time_in]
connect_bd_intf_net [get_bd_intf_pins TC_AdjustableClock_0/time_out] [get_bd_intf_pins TC_PpsGenerator_0/time_in]
connect_bd_intf_net [get_bd_intf_pins TC_AdjustableClock_0/time_out] [get_bd_intf_pins TC_Timestamper_FpgaPps/time_in]
connect_bd_intf_net [get_bd_intf_pins TC_AdjustableClock_0/time_out] [get_bd_intf_pins TC_Timestamper_Gnss1Pps/time_in]
connect_bd_intf_net [get_bd_intf_pins TC_AdjustableClock_0/time_out] [get_bd_intf_pins TC_Timestamper_1/time_in]
connect_bd_intf_net [get_bd_intf_pins TC_AdjustableClock_0/time_out] [get_bd_intf_pins TC_Timestamper_2/time_in]
connect_bd_intf_net [get_bd_intf_pins TC_AdjustableClock_0/time_out] [get_bd_intf_pins TC_Timestamper_3/time_in]
connect_bd_intf_net [get_bd_intf_pins TC_AdjustableClock_0/time_out] [get_bd_intf_pins TC_Timestamper_4/time_in]
connect_bd_intf_net [get_bd_intf_pins TC_AdjustableClock_0/time_out] [get_bd_intf_pins TC_SignalGenerator_1/time_in]
connect_bd_intf_net [get_bd_intf_pins TC_AdjustableClock_0/time_out] [get_bd_intf_pins TC_SignalGenerator_2/time_in]
connect_bd_intf_net [get_bd_intf_pins TC_AdjustableClock_0/time_out] [get_bd_intf_pins TC_SignalGenerator_3/time_in]
connect_bd_intf_net [get_bd_intf_pins TC_AdjustableClock_0/time_out] [get_bd_intf_pins TC_SignalGenerator_4/time_in]
connect_bd_intf_net [get_bd_intf_pins TC_AdjustableClock_0/time_out] [get_bd_intf_pins TC_TodSlave_0/time_in]
connect_bd_intf_net [get_bd_intf_ports Mhz200Clk_ClkIn] [get_bd_intf_pins clk_wiz_0/CLK_IN1_D]
connect_bd_intf_net [get_bd_intf_pins axi_interconnect_0/M07_AXI] [get_bd_intf_pins axi_uart16550_reserved/S_AXI]
connect_bd_intf_net [get_bd_intf_pins axi_interconnect_0/M10_AXI] [get_bd_intf_pins axi_pcie_0/S_AXI_CTL]
connect_bd_intf_net [get_bd_intf_pins TC_SmaSelector_0/axi4l_slave2] [get_bd_intf_pins axi_interconnect_0/M13_AXI]
connect_bd_intf_net [get_bd_intf_pins axi_interconnect_0/M00_AXI] [get_bd_intf_pins axi_interconnect_timecard/S00_AXI]
connect_bd_intf_net [get_bd_intf_pins axi_interconnect_0/M08_AXI] [get_bd_intf_pins axi_quad_spi_flash/AXI_LITE]
connect_bd_intf_net [get_bd_intf_pins axi_gpio_ext/S_AXI] [get_bd_intf_pins axi_interconnect_GPIO/M00_AXI]
connect_bd_intf_net [get_bd_intf_pins TC_AdjustableClock_0/servo_drift] [get_bd_intf_pins TC_PpsSlave_0/servo_drift_factor_in]
connect_bd_intf_net [get_bd_intf_pins axi_interconnect_0/M06_AXI] [get_bd_intf_pins axi_uart16550_gnss2/S_AXI]
connect_bd_intf_net [get_bd_intf_pins axi_interconnect_0/M02_AXI] [get_bd_intf_pins axi_interconnect_IIC/S00_AXI]
connect_bd_intf_net [get_bd_intf_pins axi_interconnect_0/M11_AXI] [get_bd_intf_pins axi_uart16550_ext/S_AXI]
connect_bd_intf_net [get_bd_intf_pins TC_SmaSelector_0/axi4l_slave1] [get_bd_intf_pins axi_interconnect_0/M12_AXI]
connect_bd_intf_net [get_bd_intf_pins TC_ClockDetector_0/axi4l_slave] [get_bd_intf_pins axi_interconnect_0/M14_AXI]
connect_bd_intf_net [get_bd_intf_ports GpioGnss_DatOut] [get_bd_intf_pins axi_gpio_gnss_mac/GPIO2]
connect_bd_intf_net [get_bd_intf_pins axi_interconnect_0/M01_AXI] [get_bd_intf_pins axi_interconnect_GPIO/S00_AXI]
connect_bd_intf_net [get_bd_intf_pins axi_iic_clock/S_AXI] [get_bd_intf_pins axi_interconnect_0/M15_AXI]
connect_bd_intf_net [get_bd_intf_pins TC_AdjustableClock_0/servo_offset] [get_bd_intf_pins TC_PpsSlave_0/servo_offset_factor_in]
connect_bd_intf_net [get_bd_intf_pins axi_interconnect_0/M05_AXI] [get_bd_intf_pins axi_uart16550_gnss1/S_AXI]
connect_bd_intf_net [get_bd_intf_pins axi_hwicap_0/S_AXI_LITE] [get_bd_intf_pins axi_interconnect_0/M09_AXI]
connect_bd_intf_net [get_bd_intf_pins axi_gpio_gnss_mac/S_AXI] [get_bd_intf_pins axi_interconnect_GPIO/M01_AXI]
connect_bd_intf_net [get_bd_intf_pins axi_iic/S_AXI] [get_bd_intf_pins axi_interconnect_IIC/M00_AXI]
connect_bd_intf_net [get_bd_intf_pins axi_interconnect_0/M04_AXI] [get_bd_intf_pins axi_uart16550_mac/S_AXI]
connect_bd_intf_net [get_bd_intf_ports I2c] [get_bd_intf_pins axi_iic/IIC]
connect_bd_intf_net [get_bd_intf_pins TC_FpgaVersion_0/axi4l_slave] [get_bd_intf_pins axi_interconnect_0/M03_AXI]
connect_bd_intf_net [get_bd_intf_pins TC_PpsSlave_0/axi4l_slave] [get_bd_intf_pins axi_interconnect_timecard/M17_AXI]
connect_bd_intf_net [get_bd_intf_pins TC_DummyAxiSlave_4/axi4l_slave] [get_bd_intf_pins axi_interconnect_timecard/M23_AXI]
connect_bd_intf_net [get_bd_intf_pins TC_FrequencyCounter_3/axi4l_slave] [get_bd_intf_pins axi_interconnect_timecard/M14_AXI]
connect_bd_intf_net [get_bd_intf_pins TC_AdjustableClock_0/axi4l_slave] [get_bd_intf_pins axi_interconnect_timecard/M00_AXI]
connect_bd_intf_net [get_bd_intf_pins TC_Timestamper_1/axi4l_slave] [get_bd_intf_pins axi_interconnect_timecard/M04_AXI]
connect_bd_intf_net [get_bd_intf_pins TC_FrequencyCounter_4/axi4l_slave] [get_bd_intf_pins axi_interconnect_timecard/M15_AXI]
connect_bd_intf_net [get_bd_intf_ports SpiFlash] [get_bd_intf_pins axi_quad_spi_flash/SPI_0]
connect_bd_intf_net [get_bd_intf_pins TC_SignalGenerator_2/axi4l_slave] [get_bd_intf_pins axi_interconnect_timecard/M09_AXI]
connect_bd_intf_net [get_bd_intf_pins TC_PpsGenerator_0/axi4l_slave] [get_bd_intf_pins axi_interconnect_timecard/M01_AXI]
connect_bd_intf_net [get_bd_intf_pins TC_DummyAxiSlave_0/axi4l_slave] [get_bd_intf_pins axi_interconnect_timecard/M19_AXI]
connect_bd_intf_net [get_bd_intf_pins TC_SignalGenerator_4/axi4l_slave] [get_bd_intf_pins axi_interconnect_timecard/M11_AXI]
connect_bd_intf_net [get_bd_intf_pins TC_TodSlave_0/axi4l_slave] [get_bd_intf_pins axi_interconnect_timecard/M18_AXI]
connect_bd_intf_net [get_bd_intf_pins TC_Timestamper_Gnss1Pps/axi4l_slave] [get_bd_intf_pins axi_interconnect_timecard/M03_AXI]
connect_bd_intf_net [get_bd_intf_pins TC_DummyAxiSlave_1/axi4l_slave] [get_bd_intf_pins axi_interconnect_timecard/M20_AXI]
connect_bd_intf_net [get_bd_intf_pins TC_Timestamper_4/axi4l_slave] [get_bd_intf_pins axi_interconnect_timecard/M07_AXI]
connect_bd_intf_net [get_bd_intf_pins TC_Timestamper_FpgaPps/axi4l_slave] [get_bd_intf_pins axi_interconnect_timecard/M02_AXI]
connect_bd_intf_net [get_bd_intf_ports pcie_7x_mgt_0] [get_bd_intf_pins axi_pcie_0/pcie_7x_mgt]
connect_bd_intf_net [get_bd_intf_pins TC_Timestamper_3/axi4l_slave] [get_bd_intf_pins axi_interconnect_timecard/M06_AXI]
connect_bd_intf_net [get_bd_intf_pins TC_Timestamper_2/axi4l_slave] [get_bd_intf_pins axi_interconnect_timecard/M05_AXI]
connect_bd_intf_net [get_bd_intf_pins TC_FrequencyCounter_1/axi4l_slave] [get_bd_intf_pins axi_interconnect_timecard/M12_AXI]
connect_bd_intf_net [get_bd_intf_pins TC_CoreList_0/axi4l_slave] [get_bd_intf_pins axi_interconnect_timecard/M16_AXI]
connect_bd_intf_net [get_bd_intf_pins TC_SignalGenerator_3/axi4l_slave] [get_bd_intf_pins axi_interconnect_timecard/M10_AXI]
connect_bd_intf_net [get_bd_intf_pins TC_DummyAxiSlave_2/axi4l_slave] [get_bd_intf_pins axi_interconnect_timecard/M21_AXI]
connect_bd_intf_net [get_bd_intf_pins TC_DummyAxiSlave_3/axi4l_slave] [get_bd_intf_pins axi_interconnect_timecard/M22_AXI]
connect_bd_intf_net [get_bd_intf_pins axi_interconnect_0/S00_AXI] [get_bd_intf_pins axi_pcie_0/M_AXI]
connect_bd_intf_net [get_bd_intf_pins TC_FrequencyCounter_2/axi4l_slave] [get_bd_intf_pins axi_interconnect_timecard/M13_AXI]
connect_bd_intf_net [get_bd_intf_pins TC_SignalGenerator_1/axi4l_slave] [get_bd_intf_pins axi_interconnect_timecard/M08_AXI]
connect_bd_net -net ARESETN_1 [get_bd_pins proc_sys_reset_1/interconnect_aresetn] \
  [get_bd_pins axi_interconnect_0/ARESETN] [get_bd_pins axi_interconnect_0/S00_ARESETN] [get_bd_pins axi_pcie_0/axi_aresetn]
connect_bd_net [get_bd_pins BufgMux_IPI_0/ClkOut_ClkOut] [get_bd_pins BufgMux_IPI_2/ClkIn0_ClkIn]
connect_bd_net [get_bd_pins BufgMux_IPI_1/ClkOut_ClkOut] [get_bd_pins BufgMux_IPI_2/ClkIn1_ClkIn]
connect_bd_net [get_bd_pins BufgMux_IPI_2/ClkOut_ClkOut] [get_bd_pins clk_wiz_1/clk_in1]
connect_bd_net [get_bd_ports Clk_RxSda_DatIn] [get_bd_pins TC_CommunicationSele_0/RxSda_DatIn]
connect_bd_net [get_bd_ports GoldenImageN_EnaIn] [get_bd_pins TC_FpgaVersion_0/GoldenImageN_EnaIn]
connect_bd_net -net M00_ARESETN_1 [get_bd_pins proc_sys_reset_2/interconnect_aresetn] \
  [get_bd_pins axi_interconnect_0/M00_ARESETN] [get_bd_pins axi_interconnect_0/S01_ARESETN] \
  [get_bd_pins axi_interconnect_timecard/ARESETN] [get_bd_pins axi_interconnect_timecard/M00_ARESETN] \
  [get_bd_pins axi_interconnect_timecard/M01_ARESETN] [get_bd_pins axi_interconnect_timecard/M02_ARESETN] \
  [get_bd_pins axi_interconnect_timecard/M03_ARESETN] [get_bd_pins axi_interconnect_timecard/M04_ARESETN] \
  [get_bd_pins axi_interconnect_timecard/M05_ARESETN] [get_bd_pins axi_interconnect_timecard/M06_ARESETN] \
  [get_bd_pins axi_interconnect_timecard/M07_ARESETN] [get_bd_pins axi_interconnect_timecard/M08_ARESETN] \
  [get_bd_pins axi_interconnect_timecard/M09_ARESETN] [get_bd_pins axi_interconnect_timecard/M10_ARESETN] \
  [get_bd_pins axi_interconnect_timecard/M11_ARESETN] [get_bd_pins axi_interconnect_timecard/M12_ARESETN] \
  [get_bd_pins axi_interconnect_timecard/M13_ARESETN] [get_bd_pins axi_interconnect_timecard/M14_ARESETN] \
  [get_bd_pins axi_interconnect_timecard/M15_ARESETN] [get_bd_pins axi_interconnect_timecard/M16_ARESETN] \
  [get_bd_pins axi_interconnect_timecard/M17_ARESETN] [get_bd_pins axi_interconnect_timecard/M18_ARESETN] \
  [get_bd_pins axi_interconnect_timecard/M19_ARESETN] [get_bd_pins axi_interconnect_timecard/M20_ARESETN] \
  [get_bd_pins axi_interconnect_timecard/M21_ARESETN] [get_bd_pins axi_interconnect_timecard/M22_ARESETN] \
  [get_bd_pins axi_interconnect_timecard/M23_ARESETN] [get_bd_pins axi_interconnect_timecard/S00_ARESETN]
connect_bd_net -net M02_ACLK_1 [get_bd_pins clk_wiz_0/clk_out1] \
  [get_bd_ports Mhz50Clk_ClkOut_0] [get_bd_pins TC_ClockDetector_0/SysClk_ClkIn] [get_bd_pins TC_FpgaVersion_0/SysClk_ClkIn] \
  [get_bd_pins TC_PpsSourceSelector_0/SysClk_ClkIn] [get_bd_pins TC_PpsSourceSelector_1/SysClk_ClkIn] \
  [get_bd_pins TC_SmaSelector_0/SysClk_ClkIn] [get_bd_pins axi_gpio_ext/s_axi_aclk] \
  [get_bd_pins axi_gpio_gnss_mac/s_axi_aclk] [get_bd_pins axi_hwicap_0/icap_clk] [get_bd_pins axi_hwicap_0/s_axi_aclk] \
  [get_bd_pins axi_iic/s_axi_aclk] [get_bd_pins axi_iic_clock/s_axi_aclk] [get_bd_pins axi_interconnect_0/M01_ACLK] \
  [get_bd_pins axi_interconnect_0/M02_ACLK] [get_bd_pins axi_interconnect_0/M03_ACLK] \
  [get_bd_pins axi_interconnect_0/M04_ACLK] [get_bd_pins axi_interconnect_0/M05_ACLK] \
  [get_bd_pins axi_interconnect_0/M06_ACLK] [get_bd_pins axi_interconnect_0/M07_ACLK] \
  [get_bd_pins axi_interconnect_0/M08_ACLK] [get_bd_pins axi_interconnect_0/M09_ACLK] \
  [get_bd_pins axi_interconnect_0/M11_ACLK] [get_bd_pins axi_interconnect_0/M12_ACLK] \
  [get_bd_pins axi_interconnect_0/M13_ACLK] [get_bd_pins axi_interconnect_0/M14_ACLK] \
  [get_bd_pins axi_interconnect_0/M15_ACLK] [get_bd_pins axi_interconnect_GPIO/ACLK] \
  [get_bd_pins axi_interconnect_GPIO/M00_ACLK] [get_bd_pins axi_interconnect_GPIO/M01_ACLK] \
  [get_bd_pins axi_interconnect_GPIO/S00_ACLK] [get_bd_pins axi_interconnect_IIC/ACLK] \
  [get_bd_pins axi_interconnect_IIC/M00_ACLK] [get_bd_pins axi_interconnect_IIC/S00_ACLK] \
  [get_bd_pins axi_quad_spi_flash/s_axi_aclk] [get_bd_pins axi_uart16550_ext/s_axi_aclk] \
  [get_bd_pins axi_uart16550_gnss1/s_axi_aclk] [get_bd_pins axi_uart16550_gnss2/s_axi_aclk] \
  [get_bd_pins axi_uart16550_mac/s_axi_aclk] [get_bd_pins axi_uart16550_reserved/s_axi_aclk] \
  [get_bd_pins proc_sys_reset_0/slowest_sync_clk]
connect_bd_net -net M10_ARESETN_1 [get_bd_pins proc_sys_reset_1/peripheral_aresetn] \
  [get_bd_ports Reset62_5MhzN_RstOut] [get_bd_pins TC_MsiIrq_0/SysRstN_RstIn] [get_bd_pins axi_interconnect_0/M10_ARESETN]
connect_bd_net [get_bd_ports MacPps_EvtIn] [get_bd_pins TC_PpsSourceSelector_0/MacPps_EvtIn] [get_bd_pins TC_SmaSelector_0/SmaMacPpsSource_EvtIn]
connect_bd_net [get_bd_ports Mhz10ClkDcxo1_ClkIn] [get_bd_pins BufgMux_IPI_1/ClkIn0_ClkIn] [get_bd_pins TC_ClockDetector_0/Mhz10ClkDcxo1_ClkIn]
connect_bd_net [get_bd_ports Mhz10ClkDcxo2_ClkIn] [get_bd_pins BufgMux_IPI_1/ClkIn1_ClkIn] [get_bd_pins TC_ClockDetector_0/Mhz10ClkDcxo2_ClkIn]
connect_bd_net [get_bd_ports Mhz10ClkMac_ClkIn] \
  [get_bd_pins BufgMux_IPI_0/ClkIn1_ClkIn] [get_bd_pins TC_ClockDetector_0/Mhz10ClkMac_ClkIn] \
  [get_bd_pins TC_SmaSelector_0/Sma10MHzSource_ClkIn]
connect_bd_net [get_bd_ports Mhz10ClkSma_ClkIn] [get_bd_pins util_ds_buf_0/BUFGCE_I]
connect_bd_net [get_bd_ports PciePerstN_RstIn] [get_bd_pins proc_sys_reset_1/aux_reset_in]
connect_bd_net [get_bd_ports PcieRefClockN] [get_bd_pins util_ds_buf_1/IBUF_DS_N]
connect_bd_net [get_bd_ports PcieRefClockP] [get_bd_pins util_ds_buf_1/IBUF_DS_P]
connect_bd_net [get_bd_ports PpsGnss1_EvtIn] \
  [get_bd_pins TC_PpsSourceSelector_0/GnssPps_EvtIn] [get_bd_pins TC_SmaSelector_0/SmaGnss1PpsSource_EvtIn] \
  [get_bd_pins TC_Timestamper_Gnss1Pps/SignalTimestamper_EvtIn]
connect_bd_net [get_bd_ports PpsGnss2_EvtIn] [get_bd_pins TC_PpsSourceSelector_1/GnssPps_EvtIn] [get_bd_pins TC_SmaSelector_0/SmaGnss2PpsSource_EvtIn]
connect_bd_net [get_bd_ports ResetN_RstIn] \
  [get_bd_pins clk_wiz_0/resetn] [get_bd_pins proc_sys_reset_0/ext_reset_in] [get_bd_pins proc_sys_reset_2/ext_reset_in]
connect_bd_net [get_bd_ports SmaIn1_DatIn] [get_bd_pins TC_SmaSelector_0/SmaIn1_DatIn]
connect_bd_net [get_bd_ports SmaIn2_DatIn] [get_bd_pins TC_SmaSelector_0/SmaIn2_DatIn]
connect_bd_net [get_bd_ports SmaIn3_DatIn] [get_bd_pins TC_SmaSelector_0/SmaIn3_DatIn]
connect_bd_net [get_bd_ports SmaIn4_DatIn] [get_bd_pins TC_SmaSelector_0/SmaIn4_DatIn]
connect_bd_net [get_bd_pins TC_AdjustableClock_0/InHoldover_DatOut] [get_bd_ports InHoldover_DatOut]
connect_bd_net [get_bd_pins TC_AdjustableClock_0/InSync_DatOut] [get_bd_ports InSync_DatOut]
connect_bd_net [get_bd_pins TC_AdjustableClock_0/ServoFactorsValid_ValOut] [get_bd_pins TC_PpsSlave_0/Servo_ValIn]
connect_bd_net [get_bd_pins TC_ClockDetector_0/ClkMux1Select_EnOut] [get_bd_pins BufgMux_IPI_0/SelecteClk1_EnIn]
connect_bd_net [get_bd_pins TC_ClockDetector_0/ClkMux2Select_EnOut] [get_bd_pins BufgMux_IPI_1/SelecteClk1_EnIn]
connect_bd_net [get_bd_pins TC_ClockDetector_0/ClkMux3Select_EnOut] [get_bd_pins BufgMux_IPI_2/SelecteClk1_EnIn]
connect_bd_net [get_bd_pins TC_ClockDetector_0/ClkWiz2Select_EnOut] [get_bd_pins clk_wiz_2/clk_in_sel]
connect_bd_net [get_bd_pins TC_ClockDetector_0/ClockRstN_RstOut] \
  [get_bd_pins clk_wiz_1/resetn] [get_bd_pins clk_wiz_2/resetn] [get_bd_pins proc_sys_reset_2/aux_reset_in]
connect_bd_net [get_bd_pins TC_ClockDetector_0/PpsSourceSelect_DatOut] [get_bd_pins TC_PpsSourceSelector_0/PpsSourceSelect_DatIn]
connect_bd_net [get_bd_pins TC_CommunicationSele_0/I2cSclIn_DatOut] [get_bd_pins axi_iic_clock/scl_i]
connect_bd_net [get_bd_pins TC_CommunicationSele_0/I2cSdaIn_DatOut] [get_bd_pins axi_iic_clock/sda_i]
connect_bd_net [get_bd_pins TC_CommunicationSele_0/Irq_DatOut] [get_bd_pins TC_MsiIrq_0/IrqIn5_DatIn]
connect_bd_net [get_bd_pins TC_CommunicationSele_0/RxSdaT_EnaOut] [get_bd_ports Clk_RxSdaT_EnaOut]
connect_bd_net [get_bd_pins TC_CommunicationSele_0/RxSda_DatOut] [get_bd_ports Clk_RxSda_DatOut]
connect_bd_net [get_bd_pins TC_CommunicationSele_0/TxSclT_EnaOut] [get_bd_ports Clk_TxSclT_EnaOut]
connect_bd_net [get_bd_pins TC_CommunicationSele_0/TxScl_DatOut] [get_bd_ports Clk_TxScl_DatOut]
connect_bd_net [get_bd_pins TC_CommunicationSele_0/UartRx_DatOut] [get_bd_pins axi_uart16550_mac/sin]
connect_bd_net [get_bd_pins TC_MsiIrq_0/MsiReq_ValOut] [get_bd_pins axi_pcie_0/INTX_MSI_Request]
connect_bd_net [get_bd_pins TC_MsiIrq_0/MsiVectorNum_DatOut] [get_bd_pins axi_pcie_0/MSI_Vector_Num]
connect_bd_net [get_bd_pins TC_PpsGenerator_0/Pps_EvtOut] \
  [get_bd_ports Pps_EvtOut] [get_bd_pins TC_SmaSelector_0/SmaFpgaPpsSource_EvtIn] \
  [get_bd_pins TC_Timestamper_FpgaPps/SignalTimestamper_EvtIn]
connect_bd_net [get_bd_pins TC_PpsSourceSelector_0/MacPps_EvtOut] [get_bd_ports MacPps0_EvtOut]
connect_bd_net [get_bd_pins TC_PpsSourceSelector_0/PpsSourceAvailable_DatOut] [get_bd_pins TC_ClockDetector_0/PpsSourceAvailable_DatIn]
connect_bd_net [get_bd_pins TC_PpsSourceSelector_0/SlavePps_EvtOut] [get_bd_pins TC_PpsSlave_0/Pps_EvtIn]
connect_bd_net [get_bd_pins TC_PpsSourceSelector_1/MacPps_EvtOut] [get_bd_ports MacPps1_EvtOut]
connect_bd_net -net TC_SignalGenerator_0_SignalGenerator_EvtOut [get_bd_pins TC_SignalGenerator_1/SignalGenerator_EvtOut] \
  [get_bd_pins TC_SmaSelector_0/SmaSignalGen1Source_DatIn]
connect_bd_net -net TC_SignalGenerator_Sma1_Irq_EvtOut [get_bd_pins TC_SignalGenerator_1/Irq_EvtOut] [get_bd_pins TC_MsiIrq_0/IrqIn11_DatIn]
connect_bd_net -net TC_SignalGenerator_Sma2_Irq_EvtOut [get_bd_pins TC_SignalGenerator_2/Irq_EvtOut] [get_bd_pins TC_MsiIrq_0/IrqIn12_DatIn]
connect_bd_net -net TC_SignalGenerator_Sma2_SignalGenerator_EvtOut [get_bd_pins TC_SignalGenerator_2/SignalGenerator_EvtOut] \
  [get_bd_pins TC_SmaSelector_0/SmaSignalGen2Source_DatIn]
connect_bd_net -net TC_SignalGenerator_Sma3_Irq_EvtOut [get_bd_pins TC_SignalGenerator_3/Irq_EvtOut] [get_bd_pins TC_MsiIrq_0/IrqIn13_DatIn]
connect_bd_net -net TC_SignalGenerator_Sma3_SignalGenerator_EvtOut [get_bd_pins TC_SignalGenerator_3/SignalGenerator_EvtOut] \
  [get_bd_pins TC_SmaSelector_0/SmaSignalGen3Source_DatIn]
connect_bd_net -net TC_SignalGenerator_Sma4_Irq_EvtOut [get_bd_pins TC_SignalGenerator_4/Irq_EvtOut] [get_bd_pins TC_MsiIrq_0/IrqIn14_DatIn]
connect_bd_net -net TC_SignalGenerator_Sma4_SignalGenerator_EvtOut [get_bd_pins TC_SignalGenerator_4/SignalGenerator_EvtOut] \
  [get_bd_pins TC_SmaSelector_0/SmaSignalGen4Source_DatIn]
connect_bd_net [get_bd_pins TC_SmaSelector_0/Sma10MHzSourceEnable_EnOut] [get_bd_pins util_ds_buf_0/BUFGCE_CE]
connect_bd_net [get_bd_pins TC_SmaSelector_0/SmaExtPpsSource1_EvtOut] [get_bd_pins TC_PpsSourceSelector_0/SmaPps_EvtIn]
connect_bd_net [get_bd_pins TC_SmaSelector_0/SmaExtPpsSource2_EvtOut] [get_bd_pins TC_PpsSourceSelector_1/SmaPps_EvtIn]
connect_bd_net [get_bd_pins TC_SmaSelector_0/SmaFreqCnt1Source_EvtOut] [get_bd_pins TC_FrequencyCounter_1/Frequency_EvtIn]
connect_bd_net [get_bd_pins TC_SmaSelector_0/SmaFreqCnt2Source_EvtOut] [get_bd_pins TC_FrequencyCounter_2/Frequency_EvtIn]
connect_bd_net [get_bd_pins TC_SmaSelector_0/SmaFreqCnt3Source_EvtOut] [get_bd_pins TC_FrequencyCounter_3/Frequency_EvtIn]
connect_bd_net [get_bd_pins TC_SmaSelector_0/SmaFreqCnt4Source_EvtOut] [get_bd_pins TC_FrequencyCounter_4/Frequency_EvtIn]
connect_bd_net [get_bd_pins TC_SmaSelector_0/SmaIn1_EnOut] [get_bd_ports SmaIn1_EnOut]
connect_bd_net [get_bd_pins TC_SmaSelector_0/SmaIn2_EnOut] [get_bd_ports SmaIn2_EnOut]
connect_bd_net [get_bd_pins TC_SmaSelector_0/SmaIn3_EnOut] [get_bd_ports SmaIn3_EnOut]
connect_bd_net [get_bd_pins TC_SmaSelector_0/SmaIn4_EnOut] [get_bd_ports SmaIn4_EnOut]
connect_bd_net [get_bd_pins TC_SmaSelector_0/SmaOut1_DatOut] [get_bd_ports SmaOut1_DatOut]
connect_bd_net [get_bd_pins TC_SmaSelector_0/SmaOut1_EnOut] [get_bd_ports SmaOut1_EnOut]
connect_bd_net [get_bd_pins TC_SmaSelector_0/SmaOut2_DatOut] [get_bd_ports SmaOut2_DatOut]
connect_bd_net [get_bd_pins TC_SmaSelector_0/SmaOut2_EnOut] [get_bd_ports SmaOut2_EnOut]
connect_bd_net [get_bd_pins TC_SmaSelector_0/SmaOut3_DatOut] [get_bd_ports SmaOut3_DatOut]
connect_bd_net [get_bd_pins TC_SmaSelector_0/SmaOut3_EnOut] [get_bd_ports SmaOut3_EnOut]
connect_bd_net [get_bd_pins TC_SmaSelector_0/SmaOut4_DatOut] [get_bd_ports SmaOut4_DatOut]
connect_bd_net [get_bd_pins TC_SmaSelector_0/SmaOut4_EnOut] [get_bd_ports SmaOut4_EnOut]
connect_bd_net [get_bd_pins TC_SmaSelector_0/SmaTs1Source_EvtOut] [get_bd_pins TC_Timestamper_1/SignalTimestamper_EvtIn]
connect_bd_net [get_bd_pins TC_SmaSelector_0/SmaTs2Source_EvtOut] [get_bd_pins TC_Timestamper_2/SignalTimestamper_EvtIn]
connect_bd_net [get_bd_pins TC_SmaSelector_0/SmaTs3Source_EvtOut] [get_bd_pins TC_Timestamper_3/SignalTimestamper_EvtIn]
connect_bd_net [get_bd_pins TC_SmaSelector_0/SmaTs4Source_EvtOut] [get_bd_pins TC_Timestamper_4/SignalTimestamper_EvtIn]
connect_bd_net [get_bd_pins TC_SmaSelector_0/SmaUartExtSource_DatOut] [get_bd_pins axi_uart16550_ext/sin]
connect_bd_net -net TC_Timestamper_GnssPps_Irq_EvtOut [get_bd_pins TC_Timestamper_Gnss1Pps/Irq_EvtOut] [get_bd_pins TC_MsiIrq_0/IrqIn1_DatIn]
connect_bd_net -net TC_Timestamper_PPS_Irq_EvtOut [get_bd_pins TC_Timestamper_FpgaPps/Irq_EvtOut] [get_bd_pins TC_MsiIrq_0/IrqIn0_DatIn]
connect_bd_net -net TC_Timestamper_Sma1_Irq_EvtOut [get_bd_pins TC_Timestamper_1/Irq_EvtOut] [get_bd_pins TC_MsiIrq_0/IrqIn2_DatIn]
connect_bd_net -net TC_Timestamper_Sma2_Irq_EvtOut [get_bd_pins TC_Timestamper_2/Irq_EvtOut] [get_bd_pins TC_MsiIrq_0/IrqIn6_DatIn]
connect_bd_net -net TC_Timestamper_Sma3_Irq_EvtOut [get_bd_pins TC_Timestamper_3/Irq_EvtOut] [get_bd_pins TC_MsiIrq_0/IrqIn15_DatIn]
connect_bd_net -net TC_Timestamper_Sma4_Irq_EvtOut [get_bd_pins TC_Timestamper_4/Irq_EvtOut] [get_bd_pins TC_MsiIrq_0/IrqIn16_DatIn]
connect_bd_net -net TxScl_DatIn_0_1 [get_bd_ports Clk_TxScl_DatIn] [get_bd_pins TC_CommunicationSele_0/TxScl_DatIn]
connect_bd_net [get_bd_ports UartGnss1Rx_DatIn] \
  [get_bd_pins TC_SmaSelector_0/SmaUartGnss1Source_DatIn] [get_bd_pins TC_TodSlave_0/RxUart_DatIn] \
  [get_bd_pins axi_uart16550_gnss1/sin]
connect_bd_net [get_bd_ports UartGnss2Rx_DatIn] [get_bd_pins TC_SmaSelector_0/SmaUartGnss2Source_DatIn] [get_bd_pins axi_uart16550_gnss2/sin]
connect_bd_net [get_bd_pins axi_gpio_ext/gpio2_io_o] [get_bd_pins xlslice_0/Din] [get_bd_pins xlslice_1/Din]
connect_bd_net [get_bd_pins axi_hwicap_0/ip2intc_irpt] [get_bd_pins TC_MsiIrq_0/IrqIn8_DatIn]
connect_bd_net [get_bd_pins axi_iic_clock/iic2intc_irpt] [get_bd_pins TC_CommunicationSele_0/I2cIrq_DatIn]
connect_bd_net [get_bd_pins axi_iic_clock/scl_o] [get_bd_pins TC_CommunicationSele_0/I2cSclOut_DatIn]
connect_bd_net [get_bd_pins axi_iic_clock/scl_t] [get_bd_pins TC_CommunicationSele_0/I2cSclT_EnaIn]
connect_bd_net [get_bd_pins axi_iic_clock/sda_o] [get_bd_pins TC_CommunicationSele_0/I2cSdaOut_DatIn]
connect_bd_net [get_bd_pins axi_iic_clock/sda_t] [get_bd_pins TC_CommunicationSele_0/I2cSdaT_EnaIn]
connect_bd_net [get_bd_pins axi_iic/iic2intc_irpt] [get_bd_pins TC_MsiIrq_0/IrqIn7_DatIn]
connect_bd_net [get_bd_pins axi_pcie_0/INTX_MSI_Grant] [get_bd_pins TC_MsiIrq_0/MsiGrant_ValIn]
connect_bd_net [get_bd_pins axi_pcie_0/MSI_Vector_Width] [get_bd_pins TC_MsiIrq_0/MsiVectorWidth_DatIn]
connect_bd_net [get_bd_pins axi_pcie_0/MSI_enable] [get_bd_pins TC_MsiIrq_0/MsiIrqEnable_EnIn]
connect_bd_net [get_bd_pins axi_pcie_0/axi_aclk_out] \
  [get_bd_ports Mhz62_5Clk_ClkOut] [get_bd_pins TC_MsiIrq_0/SysClk_ClkIn] [get_bd_pins axi_interconnect_0/ACLK] \
  [get_bd_pins axi_interconnect_0/S00_ACLK] [get_bd_pins proc_sys_reset_1/slowest_sync_clk]
connect_bd_net [get_bd_pins axi_pcie_0/axi_ctl_aclk_out] [get_bd_pins axi_interconnect_0/M10_ACLK]
connect_bd_net [get_bd_pins axi_pcie_0/mmcm_lock] [get_bd_pins proc_sys_reset_1/dcm_locked]
connect_bd_net [get_bd_pins axi_quad_spi_flash/cfgclk] [get_bd_ports StartUpIo_cfgclk]
connect_bd_net [get_bd_pins axi_quad_spi_flash/cfgmclk] [get_bd_ports StartUpIo_cfgmclk]
connect_bd_net [get_bd_pins axi_quad_spi_flash/eos] [get_bd_pins axi_hwicap_0/eos_in]
connect_bd_net [get_bd_pins axi_quad_spi_flash/ip2intc_irpt] [get_bd_pins TC_MsiIrq_0/IrqIn9_DatIn]
connect_bd_net [get_bd_pins axi_quad_spi_flash/preq] [get_bd_ports StartUpIo_preq]
connect_bd_net [get_bd_pins axi_uart16550_ext/ip2intc_irpt] [get_bd_pins TC_MsiIrq_0/IrqIn19_DatIn]
connect_bd_net [get_bd_pins axi_uart16550_ext/sout] [get_bd_pins TC_SmaSelector_0/SmaUartExtSource_DatIn]
connect_bd_net [get_bd_pins axi_uart16550_gnss1/ip2intc_irpt] [get_bd_pins TC_MsiIrq_0/IrqIn3_DatIn]
connect_bd_net [get_bd_pins axi_uart16550_gnss1/sout] [get_bd_ports UartGnss1Tx_DatOut]
connect_bd_net [get_bd_pins axi_uart16550_gnss2/ip2intc_irpt] [get_bd_pins TC_MsiIrq_0/IrqIn4_DatIn]
connect_bd_net [get_bd_pins axi_uart16550_gnss2/sout] [get_bd_ports UartGnss2Tx_DatOut]
connect_bd_net [get_bd_pins axi_uart16550_mac/ip2intc_irpt] [get_bd_pins TC_CommunicationSele_0/UartIrq_DatIn]
connect_bd_net [get_bd_pins axi_uart16550_mac/sout] [get_bd_pins TC_CommunicationSele_0/UartTx_DatIn]
connect_bd_net -net axi_uart16550_nmea_ip2intc_irpt [get_bd_pins axi_uart16550_reserved/ip2intc_irpt] [get_bd_pins TC_MsiIrq_0/IrqIn10_DatIn]
connect_bd_net -net clk_wiz_0_clk_out1 [get_bd_pins clk_wiz_1/clk_out1] [get_bd_pins clk_wiz_2/clk_in2]
connect_bd_net [get_bd_pins clk_wiz_0/clk_out4] [get_bd_pins axi_quad_spi_flash/ext_spi_clk]
connect_bd_net [get_bd_pins clk_wiz_0/locked] [get_bd_pins proc_sys_reset_0/dcm_locked]
connect_bd_net -net clk_wiz_1_clk_out1 [get_bd_pins clk_wiz_2/clk_out1] \
  [get_bd_ports Mhz50Clk_ClkOut] [get_bd_pins TC_AdjustableClock_0/SysClk_ClkIn] [get_bd_pins TC_ConfMaster_0/SysClk_ClkIn] \
  [get_bd_pins TC_CoreList_0/SysClk_ClkIn] [get_bd_pins TC_DummyAxiSlave_0/SysClk_ClkIn] \
  [get_bd_pins TC_DummyAxiSlave_1/SysClk_ClkIn] [get_bd_pins TC_DummyAxiSlave_2/SysClk_ClkIn] \
  [get_bd_pins TC_DummyAxiSlave_3/SysClk_ClkIn] [get_bd_pins TC_DummyAxiSlave_4/SysClk_ClkIn] \
  [get_bd_pins TC_FrequencyCounter_1/SysClk_ClkIn] [get_bd_pins TC_FrequencyCounter_2/SysClk_ClkIn] \
  [get_bd_pins TC_FrequencyCounter_3/SysClk_ClkIn] [get_bd_pins TC_FrequencyCounter_4/SysClk_ClkIn] \
  [get_bd_pins TC_PpsGenerator_0/SysClk_ClkIn] [get_bd_pins TC_PpsSlave_0/SysClk_ClkIn] \
  [get_bd_pins TC_SignalGenerator_1/SysClk_ClkIn] [get_bd_pins TC_SignalGenerator_2/SysClk_ClkIn] \
  [get_bd_pins TC_SignalGenerator_3/SysClk_ClkIn] [get_bd_pins TC_SignalGenerator_4/SysClk_ClkIn] \
  [get_bd_pins TC_Timestamper_1/SysClk_ClkIn] [get_bd_pins TC_Timestamper_2/SysClk_ClkIn] \
  [get_bd_pins TC_Timestamper_3/SysClk_ClkIn] [get_bd_pins TC_Timestamper_4/SysClk_ClkIn] \
  [get_bd_pins TC_Timestamper_FpgaPps/SysClk_ClkIn] [get_bd_pins TC_Timestamper_Gnss1Pps/SysClk_ClkIn] \
  [get_bd_pins TC_TodSlave_0/SysClk_ClkIn] [get_bd_pins axi_interconnect_0/M00_ACLK] \
  [get_bd_pins axi_interconnect_0/S01_ACLK] [get_bd_pins axi_interconnect_timecard/ACLK] \
  [get_bd_pins axi_interconnect_timecard/M00_ACLK] [get_bd_pins axi_interconnect_timecard/M01_ACLK] \
  [get_bd_pins axi_interconnect_timecard/M02_ACLK] [get_bd_pins axi_interconnect_timecard/M03_ACLK] \
  [get_bd_pins axi_interconnect_timecard/M04_ACLK] [get_bd_pins axi_interconnect_timecard/M05_ACLK] \
  [get_bd_pins axi_interconnect_timecard/M06_ACLK] [get_bd_pins axi_interconnect_timecard/M07_ACLK] \
  [get_bd_pins axi_interconnect_timecard/M08_ACLK] [get_bd_pins axi_interconnect_timecard/M09_ACLK] \
  [get_bd_pins axi_interconnect_timecard/M10_ACLK] [get_bd_pins axi_interconnect_timecard/M11_ACLK] \
  [get_bd_pins axi_interconnect_timecard/M12_ACLK] [get_bd_pins axi_interconnect_timecard/M13_ACLK] \
  [get_bd_pins axi_interconnect_timecard/M14_ACLK] [get_bd_pins axi_interconnect_timecard/M15_ACLK] \
  [get_bd_pins axi_interconnect_timecard/M16_ACLK] [get_bd_pins axi_interconnect_timecard/M17_ACLK] \
  [get_bd_pins axi_interconnect_timecard/M18_ACLK] [get_bd_pins axi_interconnect_timecard/M19_ACLK] \
  [get_bd_pins axi_interconnect_timecard/M20_ACLK] [get_bd_pins axi_interconnect_timecard/M21_ACLK] \
  [get_bd_pins axi_interconnect_timecard/M22_ACLK] [get_bd_pins axi_interconnect_timecard/M23_ACLK] \
  [get_bd_pins axi_interconnect_timecard/S00_ACLK] [get_bd_pins proc_sys_reset_2/slowest_sync_clk]
connect_bd_net -net clk_wiz_2_clk_out2 [get_bd_pins clk_wiz_0/clk_out2] [get_bd_pins clk_wiz_2/clk_in1]
connect_bd_net [get_bd_pins clk_wiz_2/clk_out2] \
  [get_bd_pins TC_PpsGenerator_0/SysClkNx_ClkIn] [get_bd_pins TC_PpsSlave_0/SysClkNx_ClkIn] \
  [get_bd_pins TC_SignalGenerator_1/SysClkNx_ClkIn] [get_bd_pins TC_SignalGenerator_2/SysClkNx_ClkIn] \
  [get_bd_pins TC_SignalGenerator_3/SysClkNx_ClkIn] [get_bd_pins TC_SignalGenerator_4/SysClkNx_ClkIn] \
  [get_bd_pins TC_Timestamper_1/SysClkNx_ClkIn] [get_bd_pins TC_Timestamper_2/SysClkNx_ClkIn] \
  [get_bd_pins TC_Timestamper_3/SysClkNx_ClkIn] [get_bd_pins TC_Timestamper_4/SysClkNx_ClkIn] \
  [get_bd_pins TC_Timestamper_FpgaPps/SysClkNx_ClkIn] [get_bd_pins TC_Timestamper_Gnss1Pps/SysClkNx_ClkIn]
connect_bd_net [get_bd_pins clk_wiz_2/locked] [get_bd_pins proc_sys_reset_2/dcm_locked]
connect_bd_net [get_bd_pins proc_sys_reset_0/peripheral_aresetn] \
  [get_bd_ports Reset50MhzN_RstOut_0] [get_bd_pins TC_ClockDetector_0/SysRstN_RstIn] \
  [get_bd_pins TC_FpgaVersion_0/SysRstN_RstIn] [get_bd_pins TC_PpsSourceSelector_0/SysRstN_RstIn] \
  [get_bd_pins TC_PpsSourceSelector_1/SysRstN_RstIn] [get_bd_pins TC_SmaSelector_0/SysRstN_RstIn] \
  [get_bd_pins axi_gpio_ext/s_axi_aresetn] [get_bd_pins axi_gpio_gnss_mac/s_axi_aresetn] \
  [get_bd_pins axi_hwicap_0/s_axi_aresetn] [get_bd_pins axi_iic/s_axi_aresetn] [get_bd_pins axi_iic_clock/s_axi_aresetn] \
  [get_bd_pins axi_interconnect_0/M01_ARESETN] [get_bd_pins axi_interconnect_0/M02_ARESETN] \
  [get_bd_pins axi_interconnect_0/M03_ARESETN] [get_bd_pins axi_interconnect_0/M04_ARESETN] \
  [get_bd_pins axi_interconnect_0/M05_ARESETN] [get_bd_pins axi_interconnect_0/M06_ARESETN] \
  [get_bd_pins axi_interconnect_0/M07_ARESETN] [get_bd_pins axi_interconnect_0/M08_ARESETN] \
  [get_bd_pins axi_interconnect_0/M09_ARESETN] [get_bd_pins axi_interconnect_0/M11_ARESETN] \
  [get_bd_pins axi_interconnect_0/M12_ARESETN] [get_bd_pins axi_interconnect_0/M13_ARESETN] \
  [get_bd_pins axi_interconnect_0/M14_ARESETN] [get_bd_pins axi_interconnect_0/M15_ARESETN] \
  [get_bd_pins axi_interconnect_GPIO/ARESETN] [get_bd_pins axi_interconnect_GPIO/M00_ARESETN] \
  [get_bd_pins axi_interconnect_GPIO/M01_ARESETN] [get_bd_pins axi_interconnect_GPIO/S00_ARESETN] \
  [get_bd_pins axi_interconnect_IIC/ARESETN] [get_bd_pins axi_interconnect_IIC/M00_ARESETN] \
  [get_bd_pins axi_interconnect_IIC/S00_ARESETN] [get_bd_pins axi_quad_spi_flash/s_axi_aresetn] \
  [get_bd_pins axi_uart16550_ext/s_axi_aresetn] [get_bd_pins axi_uart16550_gnss1/s_axi_aresetn] \
  [get_bd_pins axi_uart16550_gnss2/s_axi_aresetn] [get_bd_pins axi_uart16550_mac/s_axi_aresetn] \
  [get_bd_pins axi_uart16550_reserved/s_axi_aresetn]
